# EAGLE schematic alltogether_8.2_4w (EAGLE 9.1.0), part 2 of 3
## Sheet 18 of 31
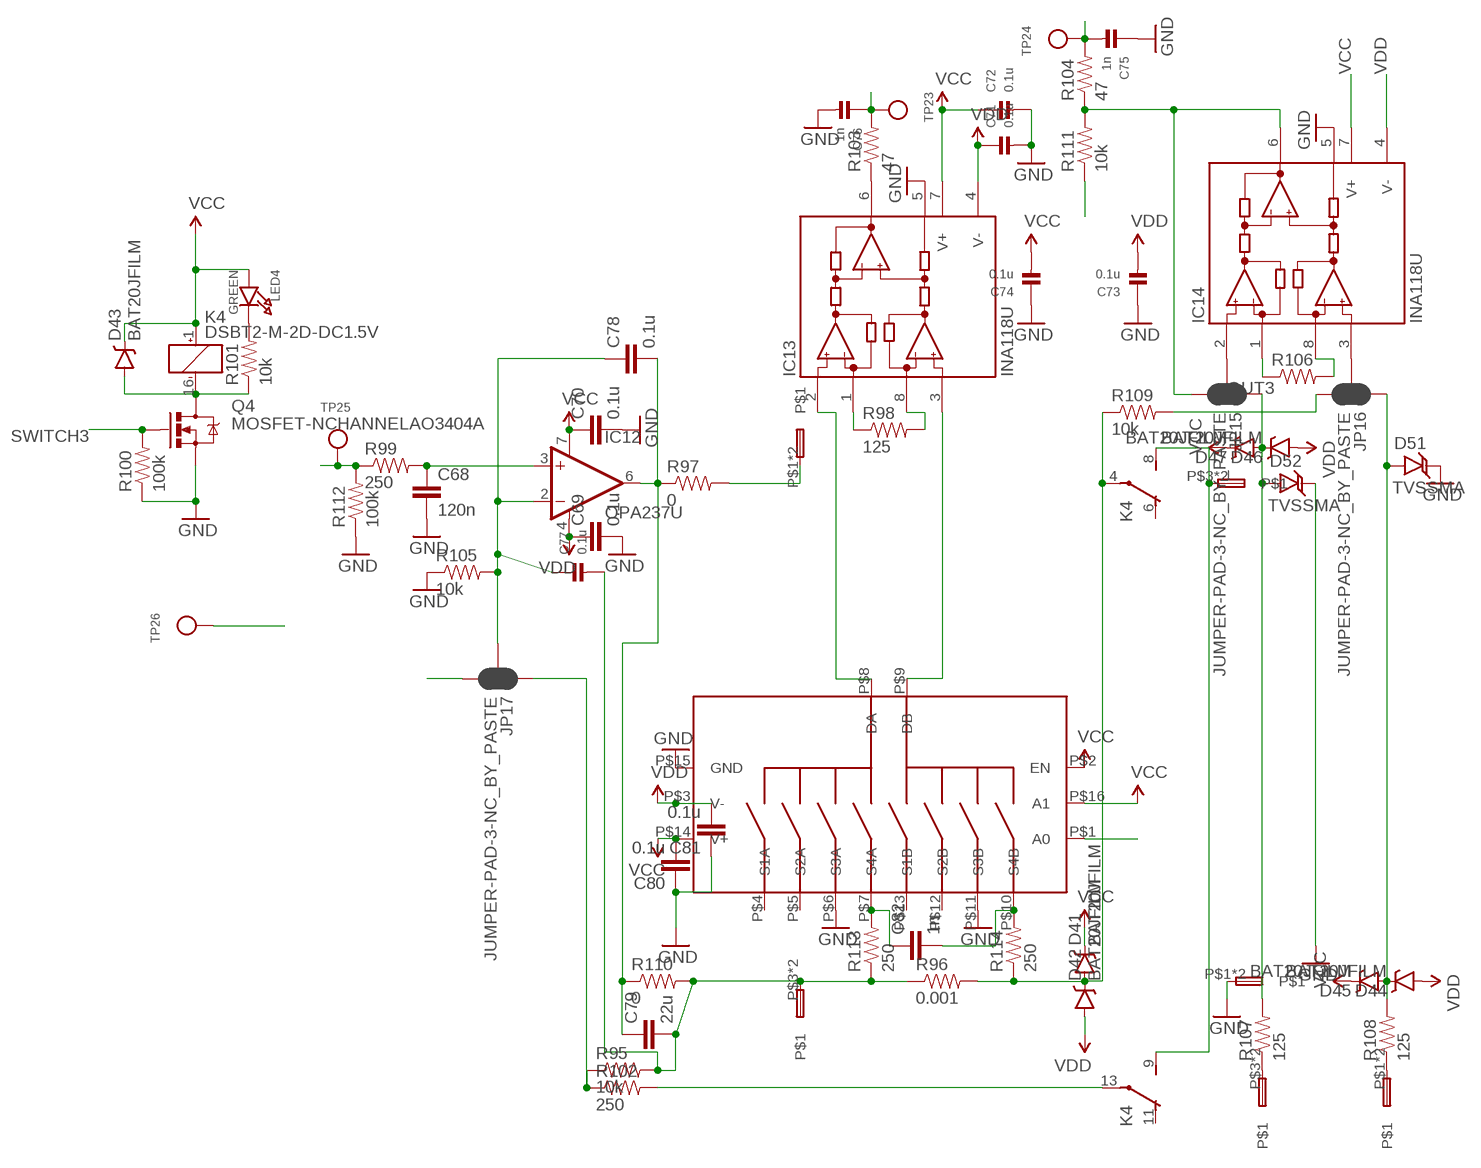
[diagram p17: schematic, sheet 18]

### Parts
C68  120n  CAP0402-CAP  [0402-CAP]
C69  0.1u  CAP0402-CAP  [0402-CAP]
C70  0.1u  CAP0402-CAP  [0402-CAP]
C71  0.1u  CAP_CERAMIC0402  [0402]
C72  0.1u  CAP_CERAMIC0402  [0402]
C73  0.1u  CAP_CERAMIC0402  [0402]
C74  0.1u  CAP_CERAMIC0402  [0402]
C75  1n  CAP_CERAMIC0402  [0402]
C76  1n  CAP_CERAMIC0402  [0402]
C77  0.1u  CAP_CERAMIC0402  [0402]
C78  0.1u  CAP0603-CAP  [0603-CAP]
C79  22u  CAP0805  [0805]
C80  0.1u  CAP0402-CAP  [0402-CAP]
C81  0.1u  CAP0402-CAP  [0402-CAP]
C82  1n  CAP0402-CAP  [0402-CAP]
D41  BAT20JFILM  [SOD-323]
D42  BAT20JFILM  [SOD-323]
D43  BAT20JFILM  [SOD-323]
D44  BAT20JFILM  [SOD-323]
D45  BAT20JFILM  [SOD-323]
D46  BAT20JFILM  [SOD-323]
D47  BAT20JFILM  [SOD-323]
D51  TVSSMA  [SMA-DIODE]
D52  TVSSMA  [SMA-DIODE]
IC12  OPA237U  [SO08]
IC13  INA118U  [SO08]
IC14  INA118U  [SO08]
JP15  JUMPER-PAD-3-NC_BY_PASTE  [PAD-JUMPER-3-NC_BY_PASTE_YES_SILK_FULL_BOX]
JP16  JUMPER-PAD-3-NC_BY_PASTE  [PAD-JUMPER-3-NC_BY_PASTE_YES_SILK_FULL_BOX]
JP17  JUMPER-PAD-3-NC_BY_PASTE  [PAD-JUMPER-3-NC_BY_PASTE_YES_SILK_FULL_BOX]
K4  DSBT2-M-2D-DC1.5V  [DS-BT]
LED4  GREEN  LED0603  [CHIPLED_0603]
Q4  MOSFET-NCHANNELAO3404A  [SOT23-3]
R95  10k  RESISTOR0402-RES  [0402-RES]
R96  0.001  0.001OHM-3W-1%(2512)3W/1%  [2512]
R97  0  RESISTOR0402-RES  [0402-RES]
R98  125  RESISTOR1206  [1206]
R99  250  RESISTOR0402-RES  [0402-RES]
R100  100k  RESISTOR0402-RES  [0402-RES]
R101  10k  RESISTOR0402-RES  [0402-RES]
R102  250  RESISTOR0402-RES  [0402-RES]
R103  47  RESISTOR0402-RES  [0402-RES]
R104  47  RESISTOR0402-RES  [0402-RES]
R105  10k  RESISTOR0402-RES  [0402-RES]
R106  RESISTOR1206  [1206]
R107  125  RESISTOR0402-RES  [0402-RES]
R108  125  RESISTOR0402-RES  [0402-RES]
R109  10k  RESISTOR0402-RES  [0402-RES]
R110  0  RESISTOR0805-RES  [0805]
R111  10k  RESISTOR0402-RES  [0402-RES]
R112  100k  RESISTOR0402-RES  [0402-RES]
R113  250  RESISTOR0402-RES  [0402-RES]
R114  250  RESISTOR0402-RES  [0402-RES]
TP23  TESTPOINT0.1"  [1X01_ROUND]
TP24  TESTPOINT0.1"  [1X01_ROUND]
TP25  TESTPOINT0.1"  [1X01_ROUND]
TP26  TESTPOINT0.1"  [1X01_ROUND]
U$20  SPTAF1/2-3.5  [SPTAF1/2-3.5]
U$21  SPTAF1/2-3.5  [SPTAF1/2-3.5]
U$22  SPTAF1/2-3.5  [SPTAF1/2-3.5]
U$23  MUX509  [R-PDSO-G16]

### Nets
A0: TP26.1 U$23.P$1(A0) ; also sheet 2,16,17,19,20,21,22,23,24,25,26,27,28,29,30,31
DAC3: R99.1 R112.2 TP25.1 ; also sheet 10
FB3: JP17.3 R111.1
GND: C68.2 C69.2 C70.2 C71.2 C72.2 C73.1 C74.1 C75.1 C76.2 C80.1 C81.1 D51.C D52.C IC13.5(REF) IC14.5(REF) Q4.2(S) R100.1 R105.1 R112.1 U$21.P$1 U$21.P$2 U$23.P$6(S3A) U$23.P$11(S3B) U$23.P$15(GND) ; also sheet 1,2,3,4,5,6,7,8,9,10,11,12,13,15,16,17,19,20,21,22,23,24,25,26,27,28,29,30,31
N$132: D41.A D42.C K4.4(2:P) R96.2 R109.1 R114.1
N$133: K4.13(3:P) R102.2
N$152: IC13.1(RG) R98.1
N$153: IC13.8(RG) R98.2
N$156: C68.1 IC12.3(+IN) R99.2
N$160: D43.A K4.16(1:-) Q4.3(D) R101.1
N$172: LED4.C R101.2
N$173: C77.1 C78.1 IC12.2(-IN) JP17.2 R105.2
N$174: C77.2 C79.2 R95.2 R96.1 R110.2 R113.1 U$20.P$3 U$20.P$4
N$175: IC13.6(OUT) R103.1
N$176: IC14.6(OUT) JP15.3 R104.1 R111.2
N$177: C78.2 C79.1 IC12.6(OUT) R97.1 R110.1
N$178: IC14.1(RG) R106.1
N$179: IC14.8(RG) R106.2
N$180: IC14.2(-IN) JP15.2
N$181: IC14.3(+IN) JP16.2
N$182: D46.C D47.A D52.A JP15.1 R107.2
N$185: R107.1 U$22.P$3 U$22.P$4
N$186: D44.C D45.A D51.A JP16.1 R108.2
N$192: R108.1 U$22.P$1 U$22.P$2
N$193: JP16.3 R109.2
N$196: JP17.1 R95.1 R102.1
N$201: R97.2 U$20.P$1 U$20.P$2
N$202: IC13.2(-IN) U$23.P$8(DA)
N$203: IC13.3(+IN) U$23.P$9(DB)
N$204: C82.2 R114.2 U$23.P$10(S4B)
N$205: C82.1 R113.2 U$23.P$7(S4A)
OUT3: K4.8(2:S) K4.9(3:S) U$21.P$3 U$21.P$4
SENSEI3: C76.1 R103.2 TP23.1 ; also sheet 8
SENSEV3: C75.2 R104.2 TP24.1 ; also sheet 8
SWITCH3: Q4.1(G) R100.2 ; also sheet 6
VCC: C70.1 C72.1 C74.2 C80.2 D41.C D43.C D45.C D47.C IC12.7(V+) IC13.7(V+) IC14.7(V+) K4.1(1:+) LED4.A U$23.P$2(EN) U$23.P$14(V+) U$23.P$16(A1) ; also sheet 1,2,3,7,8,11,13,15,16,17,19,20,21,22,23,24,25,26,27,28,29,30,31
VDD: C69.1 C71.1 C73.2 C81.2 D42.A D44.A D46.A IC12.4(V-) IC13.4(V-) IC14.4(V-) U$23.P$3(V-) ; also sheet 1,3,7,8,15,16,17,19,20,21,22,23,24,25,26,27,28,29,30,31
Unconnected: K4.6(2:O) K4.11(3:O) U$23.P$4(S1A) U$23.P$5(S2A) U$23.P$12(S2B) U$23.P$13(S1B)

## Sheet 19 of 31
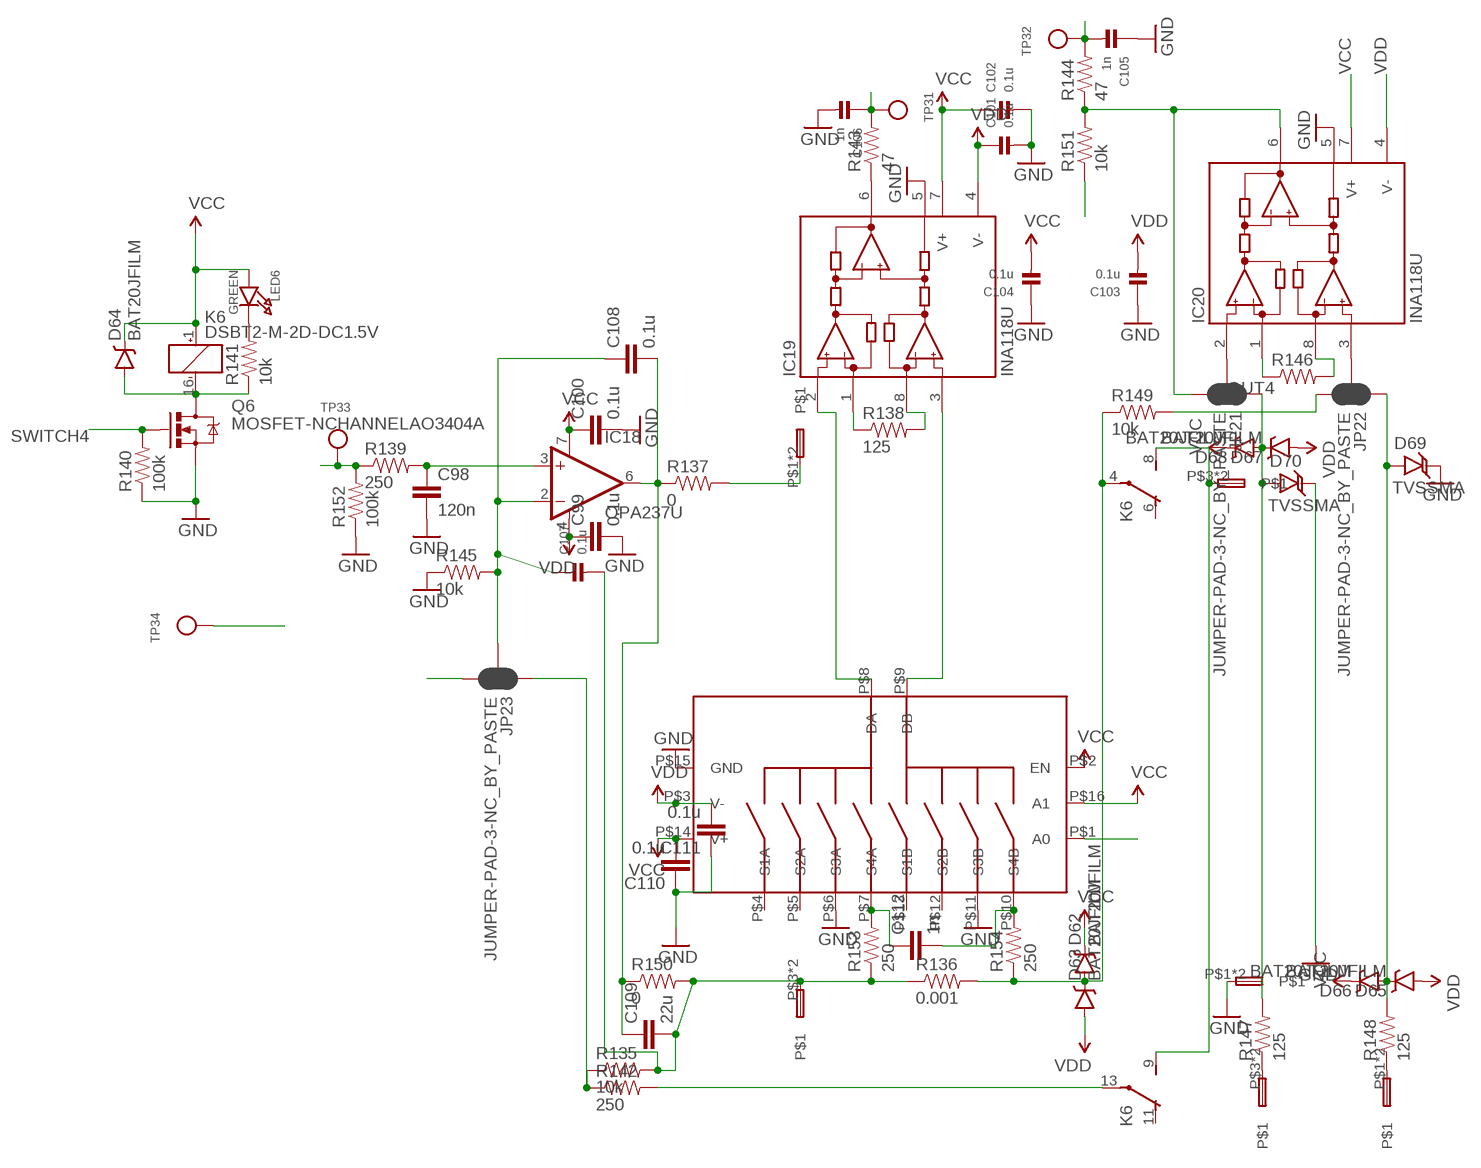
[diagram p18: schematic, sheet 19]

### Parts
C98  120n  CAP0402-CAP  [0402-CAP]
C99  0.1u  CAP0402-CAP  [0402-CAP]
C100  0.1u  CAP0402-CAP  [0402-CAP]
C101  0.1u  CAP_CERAMIC0402  [0402]
C102  0.1u  CAP_CERAMIC0402  [0402]
C103  0.1u  CAP_CERAMIC0402  [0402]
C104  0.1u  CAP_CERAMIC0402  [0402]
C105  1n  CAP_CERAMIC0402  [0402]
C106  1n  CAP_CERAMIC0402  [0402]
C107  0.1u  CAP_CERAMIC0402  [0402]
C108  0.1u  CAP0603-CAP  [0603-CAP]
C109  22u  CAP0805  [0805]
C110  0.1u  CAP0402-CAP  [0402-CAP]
C111  0.1u  CAP0402-CAP  [0402-CAP]
C112  1n  CAP0402-CAP  [0402-CAP]
D62  BAT20JFILM  [SOD-323]
D63  BAT20JFILM  [SOD-323]
D64  BAT20JFILM  [SOD-323]
D65  BAT20JFILM  [SOD-323]
D66  BAT20JFILM  [SOD-323]
D67  BAT20JFILM  [SOD-323]
D68  BAT20JFILM  [SOD-323]
D69  TVSSMA  [SMA-DIODE]
D70  TVSSMA  [SMA-DIODE]
IC18  OPA237U  [SO08]
IC19  INA118U  [SO08]
IC20  INA118U  [SO08]
JP21  JUMPER-PAD-3-NC_BY_PASTE  [PAD-JUMPER-3-NC_BY_PASTE_YES_SILK_FULL_BOX]
JP22  JUMPER-PAD-3-NC_BY_PASTE  [PAD-JUMPER-3-NC_BY_PASTE_YES_SILK_FULL_BOX]
JP23  JUMPER-PAD-3-NC_BY_PASTE  [PAD-JUMPER-3-NC_BY_PASTE_YES_SILK_FULL_BOX]
K6  DSBT2-M-2D-DC1.5V  [DS-BT]
LED6  GREEN  LED0603  [CHIPLED_0603]
Q6  MOSFET-NCHANNELAO3404A  [SOT23-3]
R135  10k  RESISTOR0402-RES  [0402-RES]
R136  0.001  0.001OHM-3W-1%(2512)3W/1%  [2512]
R137  0  RESISTOR0402-RES  [0402-RES]
R138  125  RESISTOR1206  [1206]
R139  250  RESISTOR0402-RES  [0402-RES]
R140  100k  RESISTOR0402-RES  [0402-RES]
R141  10k  RESISTOR0402-RES  [0402-RES]
R142  250  RESISTOR0402-RES  [0402-RES]
R143  47  RESISTOR0402-RES  [0402-RES]
R144  47  RESISTOR0402-RES  [0402-RES]
R145  10k  RESISTOR0402-RES  [0402-RES]
R146  RESISTOR1206  [1206]
R147  125  RESISTOR0402-RES  [0402-RES]
R148  125  RESISTOR0402-RES  [0402-RES]
R149  10k  RESISTOR0402-RES  [0402-RES]
R150  0  RESISTOR0805-RES  [0805]
R151  10k  RESISTOR0402-RES  [0402-RES]
R152  100k  RESISTOR0402-RES  [0402-RES]
R153  250  RESISTOR0402-RES  [0402-RES]
R154  250  RESISTOR0402-RES  [0402-RES]
TP31  TESTPOINT0.1"  [1X01_ROUND]
TP32  TESTPOINT0.1"  [1X01_ROUND]
TP33  TESTPOINT0.1"  [1X01_ROUND]
TP34  TESTPOINT0.1"  [1X01_ROUND]
U$28  SPTAF1/2-3.5  [SPTAF1/2-3.5]
U$29  SPTAF1/2-3.5  [SPTAF1/2-3.5]
U$30  SPTAF1/2-3.5  [SPTAF1/2-3.5]
U$31  MUX509  [R-PDSO-G16]

### Nets
A0: TP34.1 U$31.P$1(A0) ; also sheet 2,16,17,18,20,21,22,23,24,25,26,27,28,29,30,31
DAC4: R139.1 R152.2 TP33.1 ; also sheet 10
FB4: JP23.3 R151.1
GND: C98.2 C99.2 C100.2 C101.2 C102.2 C103.1 C104.1 C105.1 C106.2 C110.1 C111.1 D69.C D70.C IC19.5(REF) IC20.5(REF) Q6.2(S) R140.1 R145.1 R152.1 U$29.P$1 U$29.P$2 U$31.P$6(S3A) U$31.P$11(S3B) U$31.P$15(GND) ; also sheet 1,2,3,4,5,6,7,8,9,10,11,12,13,15,16,17,18,20,21,22,23,24,25,26,27,28,29,30,31
N$285: D62.A D63.C K6.4(2:P) R136.2 R149.1 R154.1
N$286: K6.13(3:P) R142.2
N$287: IC19.1(RG) R138.1
N$288: IC19.8(RG) R138.2
N$289: C98.1 IC18.3(+IN) R139.2
N$290: D64.A K6.16(1:-) Q6.3(D) R141.1
N$291: LED6.C R141.2
N$301: C107.1 C108.1 IC18.2(-IN) JP23.2 R145.2
N$310: C107.2 C109.2 R135.2 R136.1 R150.2 R153.1 U$28.P$3 U$28.P$4
N$311: IC19.6(OUT) R143.1
N$312: IC20.6(OUT) JP21.3 R144.1 R151.2
N$314: C108.2 C109.1 IC18.6(OUT) R137.1 R150.1
N$317: IC20.1(RG) R146.1
N$318: IC20.8(RG) R146.2
N$319: IC20.2(-IN) JP21.2
N$320: IC20.3(+IN) JP22.2
N$321: D67.C D68.A D70.A JP21.1 R147.2
N$322: R147.1 U$30.P$3 U$30.P$4
N$323: D65.C D66.A D69.A JP22.1 R148.2
N$324: R148.1 U$30.P$1 U$30.P$2
N$325: JP22.3 R149.2
N$326: JP23.1 R135.1 R142.1
N$327: R137.2 U$28.P$1 U$28.P$2
N$328: IC19.2(-IN) U$31.P$8(DA)
N$329: IC19.3(+IN) U$31.P$9(DB)
N$330: C112.2 R154.2 U$31.P$10(S4B)
N$331: C112.1 R153.2 U$31.P$7(S4A)
OUT4: K6.8(2:S) K6.9(3:S) U$29.P$3 U$29.P$4
SENSEI4: C106.1 R143.2 TP31.1 ; also sheet 8
SENSEV4: C105.2 R144.2 TP32.1 ; also sheet 8
SWITCH4: Q6.1(G) R140.2 ; also sheet 6
VCC: C100.1 C102.1 C104.2 C110.2 D62.C D64.C D66.C D68.C IC18.7(V+) IC19.7(V+) IC20.7(V+) K6.1(1:+) LED6.A U$31.P$2(EN) U$31.P$14(V+) U$31.P$16(A1) ; also sheet 1,2,3,7,8,11,13,15,16,17,18,20,21,22,23,24,25,26,27,28,29,30,31
VDD: C99.1 C101.1 C103.2 C111.2 D63.A D65.A D67.A IC18.4(V-) IC19.4(V-) IC20.4(V-) U$31.P$3(V-) ; also sheet 1,3,7,8,15,16,17,18,20,21,22,23,24,25,26,27,28,29,30,31
Unconnected: K6.6(2:O) K6.11(3:O) U$31.P$4(S1A) U$31.P$5(S2A) U$31.P$12(S2B) U$31.P$13(S1B)

## Sheet 20 of 31
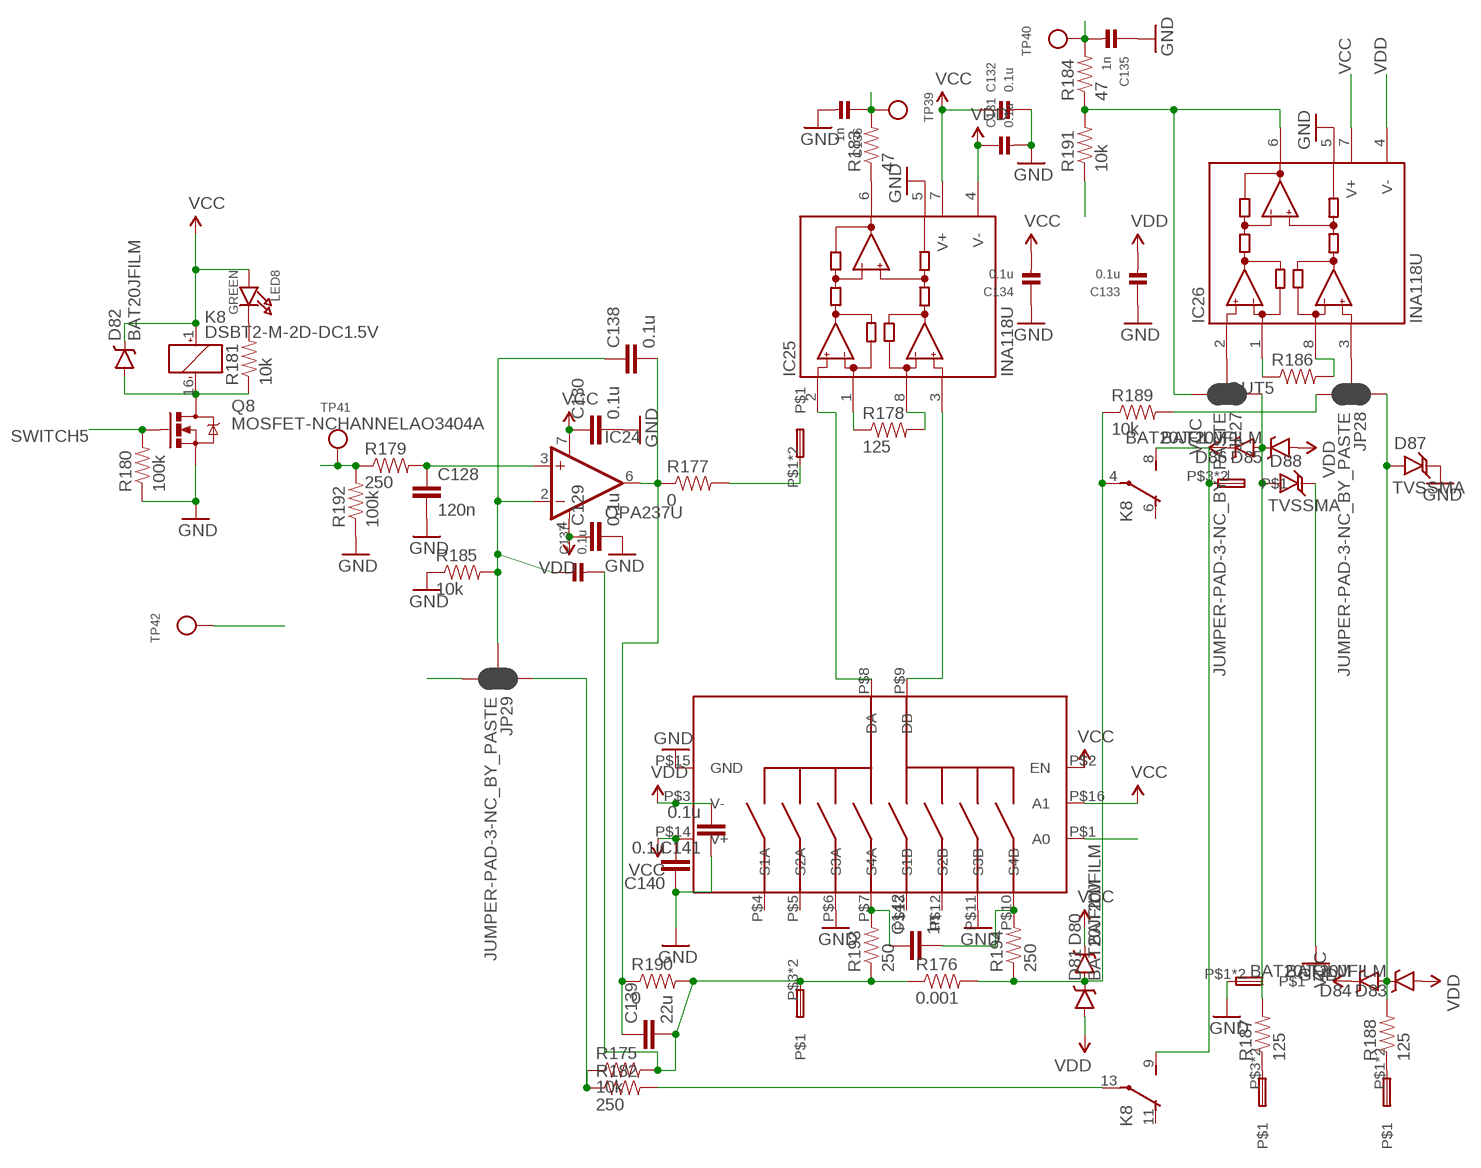
[diagram p19: schematic, sheet 20]

### Parts
C128  120n  CAP0402-CAP  [0402-CAP]
C129  0.1u  CAP0402-CAP  [0402-CAP]
C130  0.1u  CAP0402-CAP  [0402-CAP]
C131  0.1u  CAP_CERAMIC0402  [0402]
C132  0.1u  CAP_CERAMIC0402  [0402]
C133  0.1u  CAP_CERAMIC0402  [0402]
C134  0.1u  CAP_CERAMIC0402  [0402]
C135  1n  CAP_CERAMIC0402  [0402]
C136  1n  CAP_CERAMIC0402  [0402]
C137  0.1u  CAP_CERAMIC0402  [0402]
C138  0.1u  CAP0603-CAP  [0603-CAP]
C139  22u  CAP0805  [0805]
C140  0.1u  CAP0402-CAP  [0402-CAP]
C141  0.1u  CAP0402-CAP  [0402-CAP]
C142  1n  CAP0402-CAP  [0402-CAP]
D80  BAT20JFILM  [SOD-323]
D81  BAT20JFILM  [SOD-323]
D82  BAT20JFILM  [SOD-323]
D83  BAT20JFILM  [SOD-323]
D84  BAT20JFILM  [SOD-323]
D85  BAT20JFILM  [SOD-323]
D86  BAT20JFILM  [SOD-323]
D87  TVSSMA  [SMA-DIODE]
D88  TVSSMA  [SMA-DIODE]
IC24  OPA237U  [SO08]
IC25  INA118U  [SO08]
IC26  INA118U  [SO08]
JP27  JUMPER-PAD-3-NC_BY_PASTE  [PAD-JUMPER-3-NC_BY_PASTE_YES_SILK_FULL_BOX]
JP28  JUMPER-PAD-3-NC_BY_PASTE  [PAD-JUMPER-3-NC_BY_PASTE_YES_SILK_FULL_BOX]
JP29  JUMPER-PAD-3-NC_BY_PASTE  [PAD-JUMPER-3-NC_BY_PASTE_YES_SILK_FULL_BOX]
K8  DSBT2-M-2D-DC1.5V  [DS-BT]
LED8  GREEN  LED0603  [CHIPLED_0603]
Q8  MOSFET-NCHANNELAO3404A  [SOT23-3]
R175  10k  RESISTOR0402-RES  [0402-RES]
R176  0.001  0.001OHM-3W-1%(2512)3W/1%  [2512]
R177  0  RESISTOR0402-RES  [0402-RES]
R178  125  RESISTOR1206  [1206]
R179  250  RESISTOR0402-RES  [0402-RES]
R180  100k  RESISTOR0402-RES  [0402-RES]
R181  10k  RESISTOR0402-RES  [0402-RES]
R182  250  RESISTOR0402-RES  [0402-RES]
R183  47  RESISTOR0402-RES  [0402-RES]
R184  47  RESISTOR0402-RES  [0402-RES]
R185  10k  RESISTOR0402-RES  [0402-RES]
R186  RESISTOR1206  [1206]
R187  125  RESISTOR0402-RES  [0402-RES]
R188  125  RESISTOR0402-RES  [0402-RES]
R189  10k  RESISTOR0402-RES  [0402-RES]
R190  0  RESISTOR0805-RES  [0805]
R191  10k  RESISTOR0402-RES  [0402-RES]
R192  100k  RESISTOR0402-RES  [0402-RES]
R193  250  RESISTOR0402-RES  [0402-RES]
R194  250  RESISTOR0402-RES  [0402-RES]
TP39  TESTPOINT0.1"  [1X01_ROUND]
TP40  TESTPOINT0.1"  [1X01_ROUND]
TP41  TESTPOINT0.1"  [1X01_ROUND]
TP42  TESTPOINT0.1"  [1X01_ROUND]
U$37  SPTAF1/2-3.5  [SPTAF1/2-3.5]
U$39  SPTAF1/2-3.5  [SPTAF1/2-3.5]
U$40  SPTAF1/2-3.5  [SPTAF1/2-3.5]
U$41  MUX509  [R-PDSO-G16]

### Nets
A0: TP42.1 U$41.P$1(A0) ; also sheet 2,16,17,18,19,21,22,23,24,25,26,27,28,29,30,31
DAC5: R179.1 R192.2 TP41.1 ; also sheet 10
FB5: JP29.3 R191.1
GND: C128.2 C129.2 C130.2 C131.2 C132.2 C133.1 C134.1 C135.1 C136.2 C140.1 C141.1 D87.C D88.C IC25.5(REF) IC26.5(REF) Q8.2(S) R180.1 R185.1 R192.1 U$39.P$1 U$39.P$2 U$41.P$6(S3A) U$41.P$11(S3B) U$41.P$15(GND) ; also sheet 1,2,3,4,5,6,7,8,9,10,11,12,13,15,16,17,18,19,21,22,23,24,25,26,27,28,29,30,31
N$359: D80.A D81.C K8.4(2:P) R176.2 R189.1 R194.1
N$360: K8.13(3:P) R182.2
N$361: IC25.1(RG) R178.1
N$362: IC25.8(RG) R178.2
N$363: C128.1 IC24.3(+IN) R179.2
N$364: D82.A K8.16(1:-) Q8.3(D) R181.1
N$365: LED8.C R181.2
N$366: C137.1 C138.1 IC24.2(-IN) JP29.2 R185.2
N$367: C137.2 C139.2 R175.2 R176.1 R190.2 R193.1 U$37.P$3 U$37.P$4
N$368: IC25.6(OUT) R183.1
N$369: IC26.6(OUT) JP27.3 R184.1 R191.2
N$370: C138.2 C139.1 IC24.6(OUT) R177.1 R190.1
N$371: IC26.1(RG) R186.1
N$372: IC26.8(RG) R186.2
N$373: IC26.2(-IN) JP27.2
N$374: IC26.3(+IN) JP28.2
N$375: D85.C D86.A D88.A JP27.1 R187.2
N$376: R187.1 U$40.P$3 U$40.P$4
N$377: D83.C D84.A D87.A JP28.1 R188.2
N$378: R188.1 U$40.P$1 U$40.P$2
N$379: JP28.3 R189.2
N$380: JP29.1 R175.1 R182.1
N$381: R177.2 U$37.P$1 U$37.P$2
N$382: IC25.2(-IN) U$41.P$8(DA)
N$383: IC25.3(+IN) U$41.P$9(DB)
N$384: C142.2 R194.2 U$41.P$10(S4B)
N$385: C142.1 R193.2 U$41.P$7(S4A)
OUT5: K8.8(2:S) K8.9(3:S) U$39.P$3 U$39.P$4
SENSEI5: C136.1 R183.2 TP39.1 ; also sheet 8
SENSEV5: C135.2 R184.2 TP40.1 ; also sheet 8
SWITCH5: Q8.1(G) R180.2 ; also sheet 6
VCC: C130.1 C132.1 C134.2 C140.2 D80.C D82.C D84.C D86.C IC24.7(V+) IC25.7(V+) IC26.7(V+) K8.1(1:+) LED8.A U$41.P$2(EN) U$41.P$14(V+) U$41.P$16(A1) ; also sheet 1,2,3,7,8,11,13,15,16,17,18,19,21,22,23,24,25,26,27,28,29,30,31
VDD: C129.1 C131.1 C133.2 C141.2 D81.A D83.A D85.A IC24.4(V-) IC25.4(V-) IC26.4(V-) U$41.P$3(V-) ; also sheet 1,3,7,8,15,16,17,18,19,21,22,23,24,25,26,27,28,29,30,31
Unconnected: K8.6(2:O) K8.11(3:O) U$41.P$4(S1A) U$41.P$5(S2A) U$41.P$12(S2B) U$41.P$13(S1B)

## Sheet 21 of 31
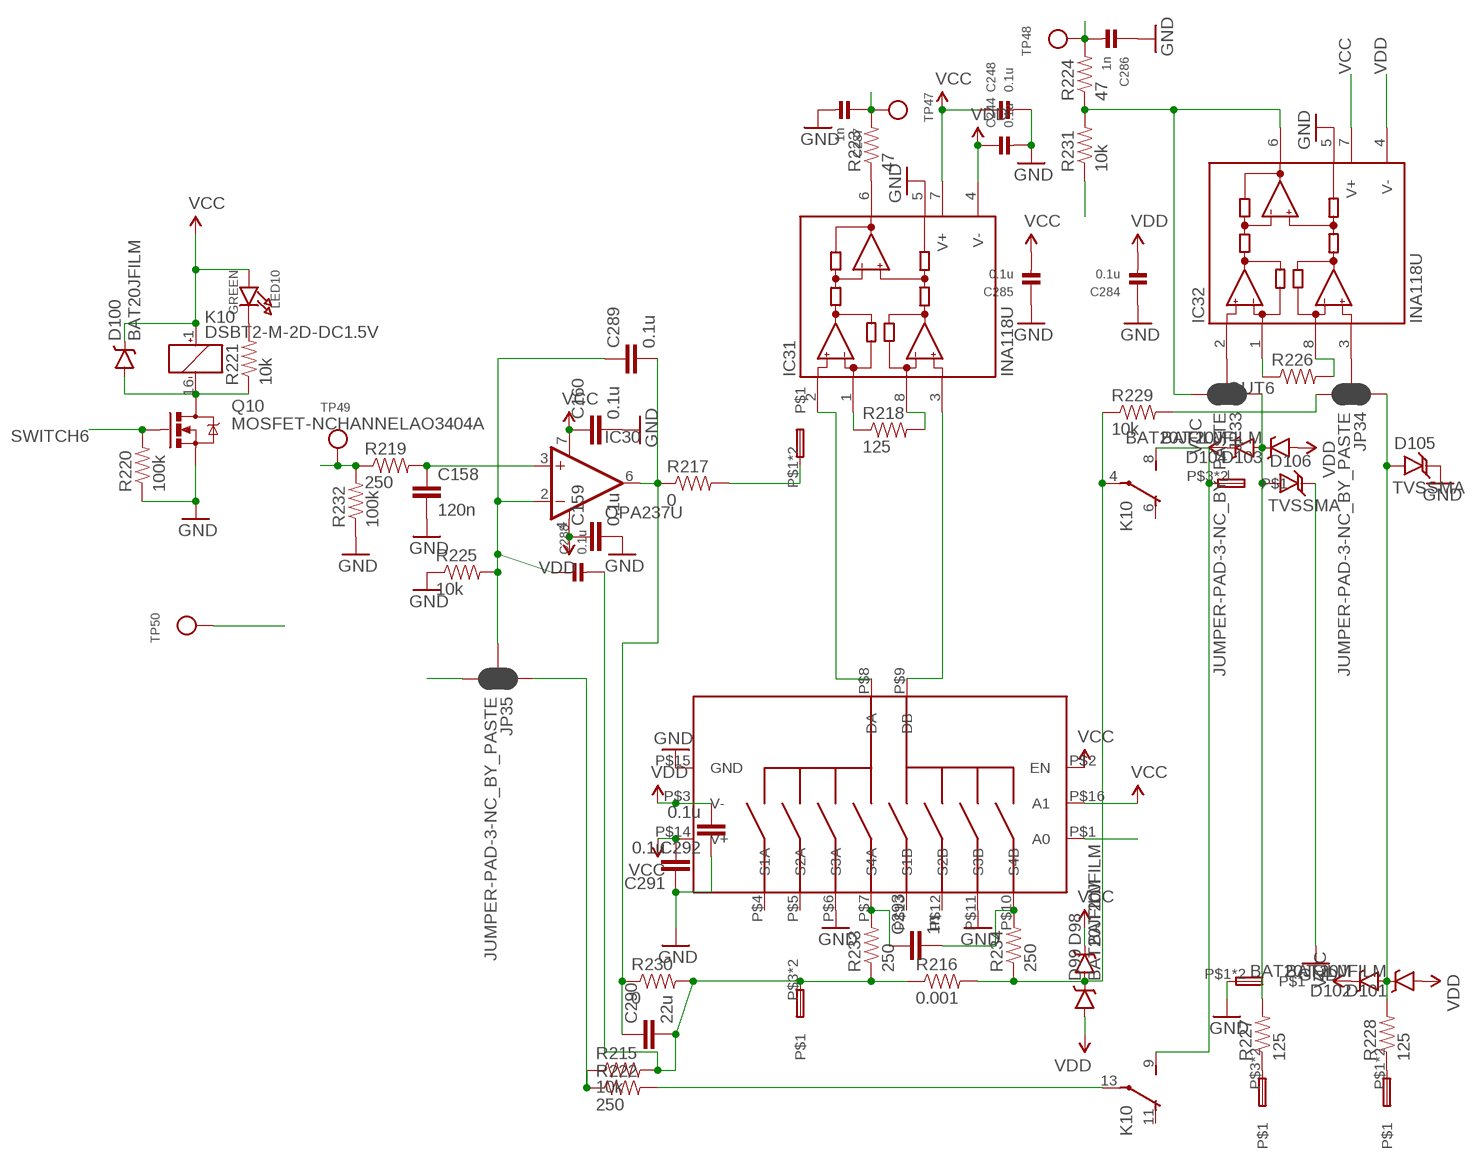
[diagram p20: schematic, sheet 21]

### Parts
C158  120n  CAP0402-CAP  [0402-CAP]
C159  0.1u  CAP0402-CAP  [0402-CAP]
C160  0.1u  CAP0402-CAP  [0402-CAP]
C244  0.1u  CAP_CERAMIC0402  [0402]
C248  0.1u  CAP_CERAMIC0402  [0402]
C284  0.1u  CAP_CERAMIC0402  [0402]
C285  0.1u  CAP_CERAMIC0402  [0402]
C286  1n  CAP_CERAMIC0402  [0402]
C287  1n  CAP_CERAMIC0402  [0402]
C288  0.1u  CAP_CERAMIC0402  [0402]
C289  0.1u  CAP0603-CAP  [0603-CAP]
C290  22u  CAP0805  [0805]
C291  0.1u  CAP0402-CAP  [0402-CAP]
C292  0.1u  CAP0402-CAP  [0402-CAP]
C293  1n  CAP0402-CAP  [0402-CAP]
D98  BAT20JFILM  [SOD-323]
D99  BAT20JFILM  [SOD-323]
D100  BAT20JFILM  [SOD-323]
D101  BAT20JFILM  [SOD-323]
D102  BAT20JFILM  [SOD-323]
D103  BAT20JFILM  [SOD-323]
D104  BAT20JFILM  [SOD-323]
D105  TVSSMA  [SMA-DIODE]
D106  TVSSMA  [SMA-DIODE]
IC30  OPA237U  [SO08]
IC31  INA118U  [SO08]
IC32  INA118U  [SO08]
JP33  JUMPER-PAD-3-NC_BY_PASTE  [PAD-JUMPER-3-NC_BY_PASTE_YES_SILK_FULL_BOX]
JP34  JUMPER-PAD-3-NC_BY_PASTE  [PAD-JUMPER-3-NC_BY_PASTE_YES_SILK_FULL_BOX]
JP35  JUMPER-PAD-3-NC_BY_PASTE  [PAD-JUMPER-3-NC_BY_PASTE_YES_SILK_FULL_BOX]
K10  DSBT2-M-2D-DC1.5V  [DS-BT]
LED10  GREEN  LED0603  [CHIPLED_0603]
Q10  MOSFET-NCHANNELAO3404A  [SOT23-3]
R215  10k  RESISTOR0402-RES  [0402-RES]
R216  0.001  0.001OHM-3W-1%(2512)3W/1%  [2512]
R217  0  RESISTOR0402-RES  [0402-RES]
R218  125  RESISTOR1206  [1206]
R219  250  RESISTOR0402-RES  [0402-RES]
R220  100k  RESISTOR0402-RES  [0402-RES]
R221  10k  RESISTOR0402-RES  [0402-RES]
R222  250  RESISTOR0402-RES  [0402-RES]
R223  47  RESISTOR0402-RES  [0402-RES]
R224  47  RESISTOR0402-RES  [0402-RES]
R225  10k  RESISTOR0402-RES  [0402-RES]
R226  RESISTOR1206  [1206]
R227  125  RESISTOR0402-RES  [0402-RES]
R228  125  RESISTOR0402-RES  [0402-RES]
R229  10k  RESISTOR0402-RES  [0402-RES]
R230  0  RESISTOR0805-RES  [0805]
R231  10k  RESISTOR0402-RES  [0402-RES]
R232  100k  RESISTOR0402-RES  [0402-RES]
R233  250  RESISTOR0402-RES  [0402-RES]
R234  250  RESISTOR0402-RES  [0402-RES]
TP47  TESTPOINT0.1"  [1X01_ROUND]
TP48  TESTPOINT0.1"  [1X01_ROUND]
TP49  TESTPOINT0.1"  [1X01_ROUND]
TP50  TESTPOINT0.1"  [1X01_ROUND]
U$46  SPTAF1/2-3.5  [SPTAF1/2-3.5]
U$47  SPTAF1/2-3.5  [SPTAF1/2-3.5]
U$51  SPTAF1/2-3.5  [SPTAF1/2-3.5]
U$52  MUX509  [R-PDSO-G16]

### Nets
A0: TP50.1 U$52.P$1(A0) ; also sheet 2,16,17,18,19,20,22,23,24,25,26,27,28,29,30,31
DAC6: R219.1 R232.2 TP49.1 ; also sheet 10
FB6: JP35.3 R231.1
GND: C158.2 C159.2 C160.2 C244.2 C248.2 C284.1 C285.1 C286.1 C287.2 C291.1 C292.1 D105.C D106.C IC31.5(REF) IC32.5(REF) Q10.2(S) R220.1 R225.1 R232.1 U$47.P$1 U$47.P$2 U$52.P$6(S3A) U$52.P$11(S3B) U$52.P$15(GND) ; also sheet 1,2,3,4,5,6,7,8,9,10,11,12,13,15,16,17,18,19,20,22,23,24,25,26,27,28,29,30,31
N$413: D98.A D99.C K10.4(2:P) R216.2 R229.1 R234.1
N$414: K10.13(3:P) R222.2
N$415: IC31.1(RG) R218.1
N$416: IC31.8(RG) R218.2
N$417: C158.1 IC30.3(+IN) R219.2
N$418: D100.A K10.16(1:-) Q10.3(D) R221.1
N$419: LED10.C R221.2
N$420: C288.1 C289.1 IC30.2(-IN) JP35.2 R225.2
N$421: C288.2 C290.2 R215.2 R216.1 R230.2 R233.1 U$46.P$3 U$46.P$4
N$422: IC31.6(OUT) R223.1
N$423: IC32.6(OUT) JP33.3 R224.1 R231.2
N$424: C289.2 C290.1 IC30.6(OUT) R217.1 R230.1
N$425: IC32.1(RG) R226.1
N$426: IC32.8(RG) R226.2
N$427: IC32.2(-IN) JP33.2
N$428: IC32.3(+IN) JP34.2
N$429: D103.C D104.A D106.A JP33.1 R227.2
N$430: R227.1 U$51.P$3 U$51.P$4
N$431: D101.C D102.A D105.A JP34.1 R228.2
N$432: R228.1 U$51.P$1 U$51.P$2
N$433: JP34.3 R229.2
N$434: JP35.1 R215.1 R222.1
N$435: R217.2 U$46.P$1 U$46.P$2
N$436: IC31.2(-IN) U$52.P$8(DA)
N$437: IC31.3(+IN) U$52.P$9(DB)
N$438: C293.2 R234.2 U$52.P$10(S4B)
N$439: C293.1 R233.2 U$52.P$7(S4A)
OUT6: K10.8(2:S) K10.9(3:S) U$47.P$3 U$47.P$4
SENSEI6: C287.1 R223.2 TP47.1 ; also sheet 8
SENSEV6: C286.2 R224.2 TP48.1 ; also sheet 8
SWITCH6: Q10.1(G) R220.2 ; also sheet 6
VCC: C160.1 C248.1 C285.2 C291.2 D98.C D100.C D102.C D104.C IC30.7(V+) IC31.7(V+) IC32.7(V+) K10.1(1:+) LED10.A U$52.P$2(EN) U$52.P$14(V+) U$52.P$16(A1) ; also sheet 1,2,3,7,8,11,13,15,16,17,18,19,20,22,23,24,25,26,27,28,29,30,31
VDD: C159.1 C244.1 C284.2 C292.2 D99.A D101.A D103.A IC30.4(V-) IC31.4(V-) IC32.4(V-) U$52.P$3(V-) ; also sheet 1,3,7,8,15,16,17,18,19,20,22,23,24,25,26,27,28,29,30,31
Unconnected: K10.6(2:O) K10.11(3:O) U$52.P$4(S1A) U$52.P$5(S2A) U$52.P$12(S2B) U$52.P$13(S1B)

## Sheet 22 of 31
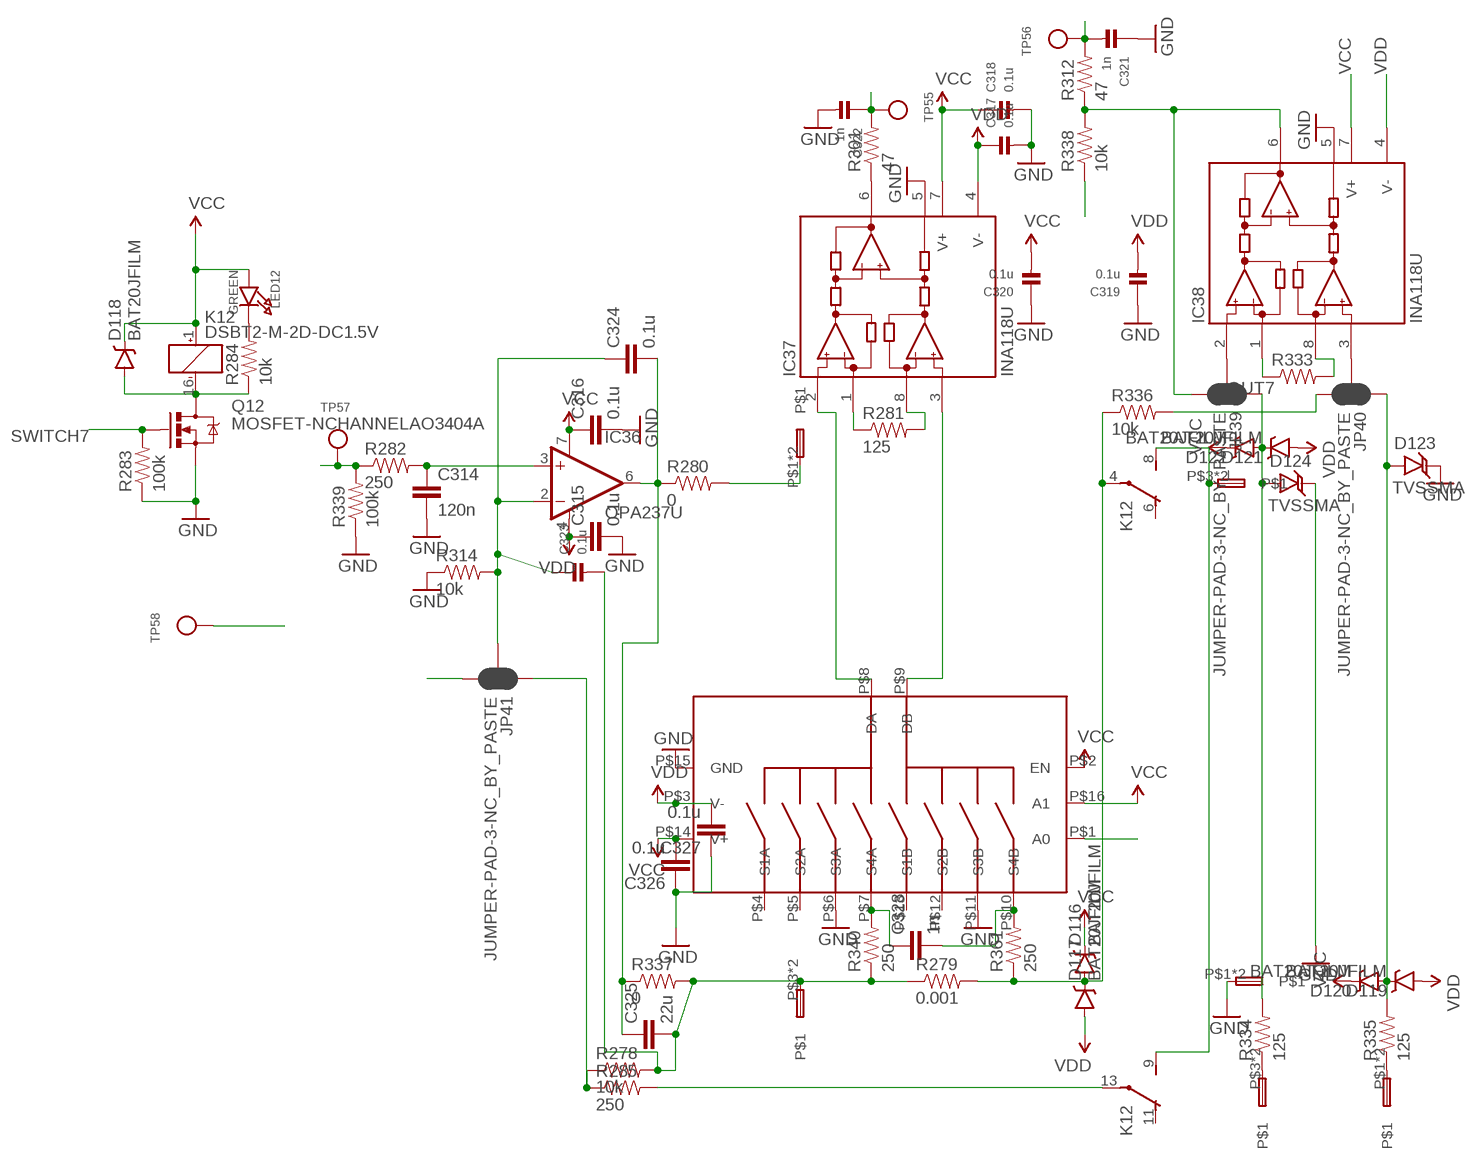
[diagram p21: schematic, sheet 22]

### Parts
C314  120n  CAP0402-CAP  [0402-CAP]
C315  0.1u  CAP0402-CAP  [0402-CAP]
C316  0.1u  CAP0402-CAP  [0402-CAP]
C317  0.1u  CAP_CERAMIC0402  [0402]
C318  0.1u  CAP_CERAMIC0402  [0402]
C319  0.1u  CAP_CERAMIC0402  [0402]
C320  0.1u  CAP_CERAMIC0402  [0402]
C321  1n  CAP_CERAMIC0402  [0402]
C322  1n  CAP_CERAMIC0402  [0402]
C323  0.1u  CAP_CERAMIC0402  [0402]
C324  0.1u  CAP0603-CAP  [0603-CAP]
C325  22u  CAP0805  [0805]
C326  0.1u  CAP0402-CAP  [0402-CAP]
C327  0.1u  CAP0402-CAP  [0402-CAP]
C328  1n  CAP0402-CAP  [0402-CAP]
D116  BAT20JFILM  [SOD-323]
D117  BAT20JFILM  [SOD-323]
D118  BAT20JFILM  [SOD-323]
D119  BAT20JFILM  [SOD-323]
D120  BAT20JFILM  [SOD-323]
D121  BAT20JFILM  [SOD-323]
D122  BAT20JFILM  [SOD-323]
D123  TVSSMA  [SMA-DIODE]
D124  TVSSMA  [SMA-DIODE]
IC36  OPA237U  [SO08]
IC37  INA118U  [SO08]
IC38  INA118U  [SO08]
JP39  JUMPER-PAD-3-NC_BY_PASTE  [PAD-JUMPER-3-NC_BY_PASTE_YES_SILK_FULL_BOX]
JP40  JUMPER-PAD-3-NC_BY_PASTE  [PAD-JUMPER-3-NC_BY_PASTE_YES_SILK_FULL_BOX]
JP41  JUMPER-PAD-3-NC_BY_PASTE  [PAD-JUMPER-3-NC_BY_PASTE_YES_SILK_FULL_BOX]
K12  DSBT2-M-2D-DC1.5V  [DS-BT]
LED12  GREEN  LED0603  [CHIPLED_0603]
Q12  MOSFET-NCHANNELAO3404A  [SOT23-3]
R278  10k  RESISTOR0402-RES  [0402-RES]
R279  0.001  0.001OHM-3W-1%(2512)3W/1%  [2512]
R280  0  RESISTOR0402-RES  [0402-RES]
R281  125  RESISTOR1206  [1206]
R282  250  RESISTOR0402-RES  [0402-RES]
R283  100k  RESISTOR0402-RES  [0402-RES]
R284  10k  RESISTOR0402-RES  [0402-RES]
R285  250  RESISTOR0402-RES  [0402-RES]
R301  47  RESISTOR0402-RES  [0402-RES]
R312  47  RESISTOR0402-RES  [0402-RES]
R314  10k  RESISTOR0402-RES  [0402-RES]
R333  RESISTOR1206  [1206]
R334  125  RESISTOR0402-RES  [0402-RES]
R335  125  RESISTOR0402-RES  [0402-RES]
R336  10k  RESISTOR0402-RES  [0402-RES]
R337  0  RESISTOR0805-RES  [0805]
R338  10k  RESISTOR0402-RES  [0402-RES]
R339  100k  RESISTOR0402-RES  [0402-RES]
R340  250  RESISTOR0402-RES  [0402-RES]
R361  250  RESISTOR0402-RES  [0402-RES]
TP55  TESTPOINT0.1"  [1X01_ROUND]
TP56  TESTPOINT0.1"  [1X01_ROUND]
TP57  TESTPOINT0.1"  [1X01_ROUND]
TP58  TESTPOINT0.1"  [1X01_ROUND]
U$57  SPTAF1/2-3.5  [SPTAF1/2-3.5]
U$58  SPTAF1/2-3.5  [SPTAF1/2-3.5]
U$61  SPTAF1/2-3.5  [SPTAF1/2-3.5]
U$65  MUX509  [R-PDSO-G16]

### Nets
A0: TP58.1 U$65.P$1(A0) ; also sheet 2,16,17,18,19,20,21,23,24,25,26,27,28,29,30,31
DAC7: R282.1 R339.2 TP57.1 ; also sheet 10
FB7: JP41.3 R338.1
GND: C314.2 C315.2 C316.2 C317.2 C318.2 C319.1 C320.1 C321.1 C322.2 C326.1 C327.1 D123.C D124.C IC37.5(REF) IC38.5(REF) Q12.2(S) R283.1 R314.1 R339.1 U$58.P$1 U$58.P$2 U$65.P$6(S3A) U$65.P$11(S3B) U$65.P$15(GND) ; also sheet 1,2,3,4,5,6,7,8,9,10,11,12,13,15,16,17,18,19,20,21,23,24,25,26,27,28,29,30,31
N$467: D116.A D117.C K12.4(2:P) R279.2 R336.1 R361.1
N$468: K12.13(3:P) R285.2
N$469: IC37.1(RG) R281.1
N$470: IC37.8(RG) R281.2
N$471: C314.1 IC36.3(+IN) R282.2
N$472: D118.A K12.16(1:-) Q12.3(D) R284.1
N$473: LED12.C R284.2
N$474: C323.1 C324.1 IC36.2(-IN) JP41.2 R314.2
N$475: C323.2 C325.2 R278.2 R279.1 R337.2 R340.1 U$57.P$3 U$57.P$4
N$476: IC37.6(OUT) R301.1
N$477: IC38.6(OUT) JP39.3 R312.1 R338.2
N$478: C324.2 C325.1 IC36.6(OUT) R280.1 R337.1
N$479: IC38.1(RG) R333.1
N$480: IC38.8(RG) R333.2
N$481: IC38.2(-IN) JP39.2
N$482: IC38.3(+IN) JP40.2
N$483: D121.C D122.A D124.A JP39.1 R334.2
N$484: R334.1 U$61.P$3 U$61.P$4
N$485: D119.C D120.A D123.A JP40.1 R335.2
N$486: R335.1 U$61.P$1 U$61.P$2
N$487: JP40.3 R336.2
N$488: JP41.1 R278.1 R285.1
N$489: R280.2 U$57.P$1 U$57.P$2
N$490: IC37.2(-IN) U$65.P$8(DA)
N$491: IC37.3(+IN) U$65.P$9(DB)
N$492: C328.2 R361.2 U$65.P$10(S4B)
N$493: C328.1 R340.2 U$65.P$7(S4A)
OUT7: K12.8(2:S) K12.9(3:S) U$58.P$3 U$58.P$4
SENSEI7: C322.1 R301.2 TP55.1 ; also sheet 8
SENSEV7: C321.2 R312.2 TP56.1 ; also sheet 8
SWITCH7: Q12.1(G) R283.2 ; also sheet 6
VCC: C316.1 C318.1 C320.2 C326.2 D116.C D118.C D120.C D122.C IC36.7(V+) IC37.7(V+) IC38.7(V+) K12.1(1:+) LED12.A U$65.P$2(EN) U$65.P$14(V+) U$65.P$16(A1) ; also sheet 1,2,3,7,8,11,13,15,16,17,18,19,20,21,23,24,25,26,27,28,29,30,31
VDD: C315.1 C317.1 C319.2 C327.2 D117.A D119.A D121.A IC36.4(V-) IC37.4(V-) IC38.4(V-) U$65.P$3(V-) ; also sheet 1,3,7,8,15,16,17,18,19,20,21,23,24,25,26,27,28,29,30,31
Unconnected: K12.6(2:O) K12.11(3:O) U$65.P$4(S1A) U$65.P$5(S2A) U$65.P$12(S2B) U$65.P$13(S1B)

## Sheet 23 of 31
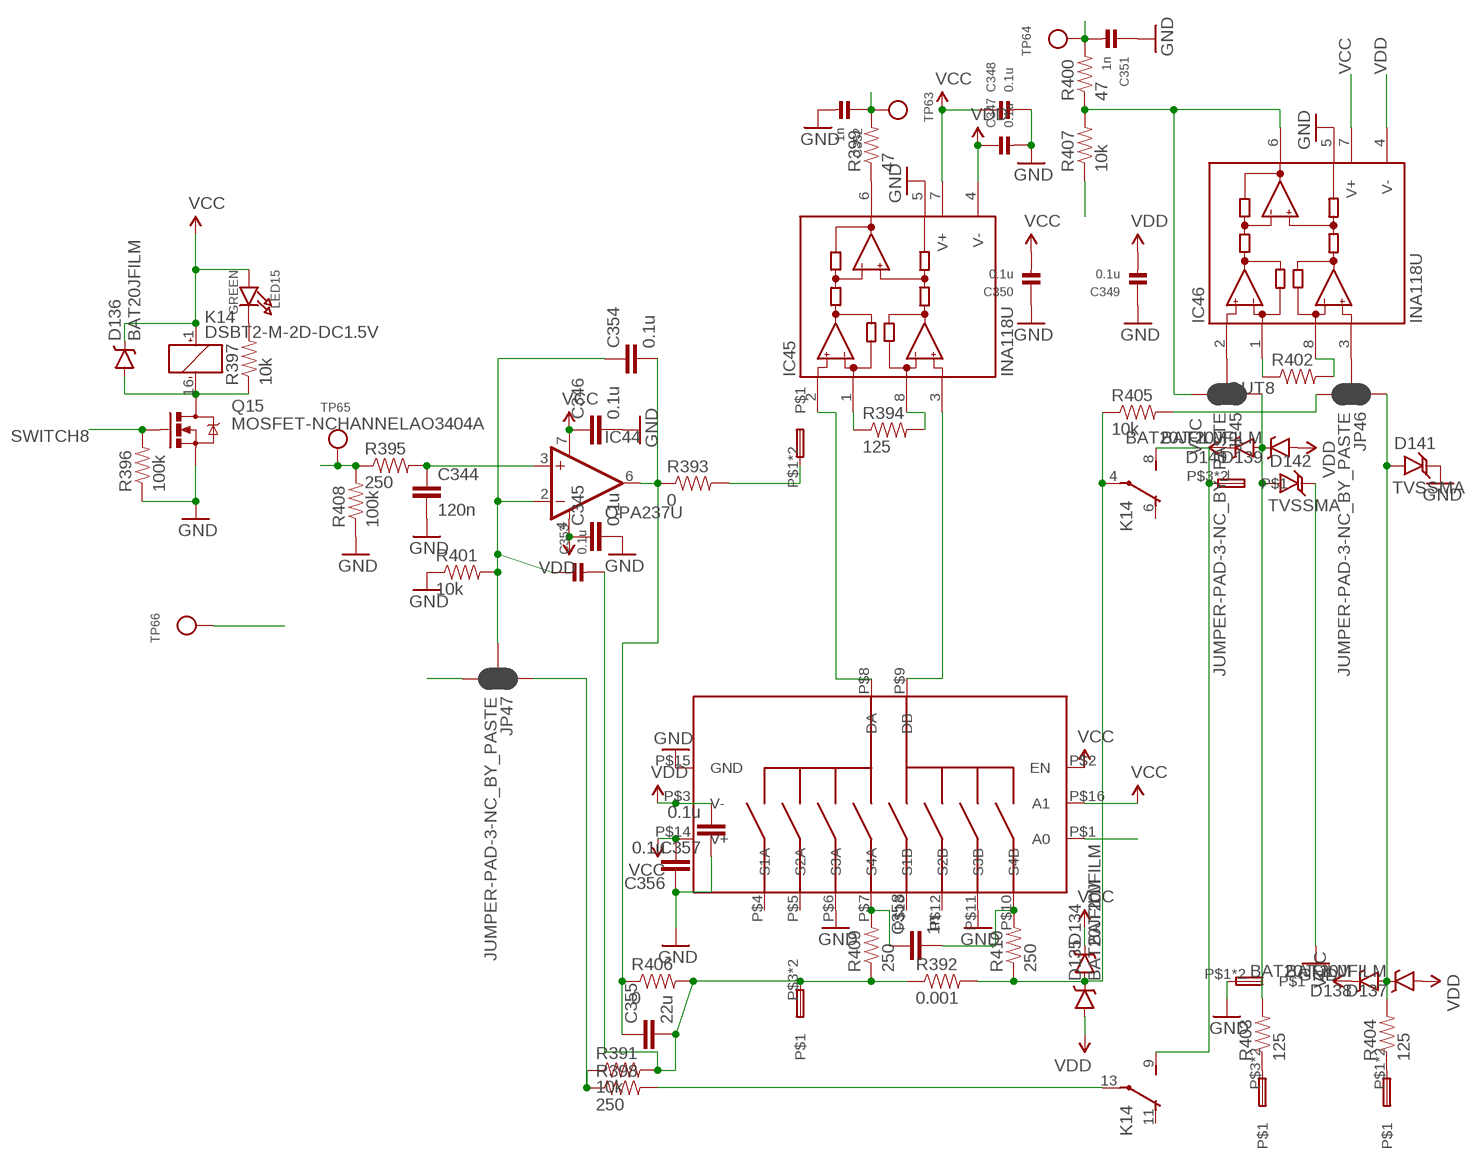
[diagram p22: schematic, sheet 23]

### Parts
C344  120n  CAP0402-CAP  [0402-CAP]
C345  0.1u  CAP0402-CAP  [0402-CAP]
C346  0.1u  CAP0402-CAP  [0402-CAP]
C347  0.1u  CAP_CERAMIC0402  [0402]
C348  0.1u  CAP_CERAMIC0402  [0402]
C349  0.1u  CAP_CERAMIC0402  [0402]
C350  0.1u  CAP_CERAMIC0402  [0402]
C351  1n  CAP_CERAMIC0402  [0402]
C352  1n  CAP_CERAMIC0402  [0402]
C353  0.1u  CAP_CERAMIC0402  [0402]
C354  0.1u  CAP0603-CAP  [0603-CAP]
C355  22u  CAP0805  [0805]
C356  0.1u  CAP0402-CAP  [0402-CAP]
C357  0.1u  CAP0402-CAP  [0402-CAP]
C358  1n  CAP0402-CAP  [0402-CAP]
D134  BAT20JFILM  [SOD-323]
D135  BAT20JFILM  [SOD-323]
D136  BAT20JFILM  [SOD-323]
D137  BAT20JFILM  [SOD-323]
D138  BAT20JFILM  [SOD-323]
D139  BAT20JFILM  [SOD-323]
D140  BAT20JFILM  [SOD-323]
D141  TVSSMA  [SMA-DIODE]
D142  TVSSMA  [SMA-DIODE]
IC44  OPA237U  [SO08]
IC45  INA118U  [SO08]
IC46  INA118U  [SO08]
JP45  JUMPER-PAD-3-NC_BY_PASTE  [PAD-JUMPER-3-NC_BY_PASTE_YES_SILK_FULL_BOX]
JP46  JUMPER-PAD-3-NC_BY_PASTE  [PAD-JUMPER-3-NC_BY_PASTE_YES_SILK_FULL_BOX]
JP47  JUMPER-PAD-3-NC_BY_PASTE  [PAD-JUMPER-3-NC_BY_PASTE_YES_SILK_FULL_BOX]
K14  DSBT2-M-2D-DC1.5V  [DS-BT]
LED15  GREEN  LED0603  [CHIPLED_0603]
Q15  MOSFET-NCHANNELAO3404A  [SOT23-3]
R391  10k  RESISTOR0402-RES  [0402-RES]
R392  0.001  0.001OHM-3W-1%(2512)3W/1%  [2512]
R393  0  RESISTOR0402-RES  [0402-RES]
R394  125  RESISTOR1206  [1206]
R395  250  RESISTOR0402-RES  [0402-RES]
R396  100k  RESISTOR0402-RES  [0402-RES]
R397  10k  RESISTOR0402-RES  [0402-RES]
R398  250  RESISTOR0402-RES  [0402-RES]
R399  47  RESISTOR0402-RES  [0402-RES]
R400  47  RESISTOR0402-RES  [0402-RES]
R401  10k  RESISTOR0402-RES  [0402-RES]
R402  RESISTOR1206  [1206]
R403  125  RESISTOR0402-RES  [0402-RES]
R404  125  RESISTOR0402-RES  [0402-RES]
R405  10k  RESISTOR0402-RES  [0402-RES]
R406  0  RESISTOR0805-RES  [0805]
R407  10k  RESISTOR0402-RES  [0402-RES]
R408  100k  RESISTOR0402-RES  [0402-RES]
R409  250  RESISTOR0402-RES  [0402-RES]
R410  250  RESISTOR0402-RES  [0402-RES]
TP63  TESTPOINT0.1"  [1X01_ROUND]
TP64  TESTPOINT0.1"  [1X01_ROUND]
TP65  TESTPOINT0.1"  [1X01_ROUND]
TP66  TESTPOINT0.1"  [1X01_ROUND]
U$71  SPTAF1/2-3.5  [SPTAF1/2-3.5]
U$72  SPTAF1/2-3.5  [SPTAF1/2-3.5]
U$73  SPTAF1/2-3.5  [SPTAF1/2-3.5]
U$74  MUX509  [R-PDSO-G16]

### Nets
A0: TP66.1 U$74.P$1(A0) ; also sheet 2,16,17,18,19,20,21,22,24,25,26,27,28,29,30,31
DAC8: R395.1 R408.2 TP65.1 ; also sheet 10
FB8: JP47.3 R407.1
GND: C344.2 C345.2 C346.2 C347.2 C348.2 C349.1 C350.1 C351.1 C352.2 C356.1 C357.1 D141.C D142.C IC45.5(REF) IC46.5(REF) Q15.2(S) R396.1 R401.1 R408.1 U$72.P$1 U$72.P$2 U$74.P$6(S3A) U$74.P$11(S3B) U$74.P$15(GND) ; also sheet 1,2,3,4,5,6,7,8,9,10,11,12,13,15,16,17,18,19,20,21,22,24,25,26,27,28,29,30,31
N$521: D134.A D135.C K14.4(2:P) R392.2 R405.1 R410.1
N$522: K14.13(3:P) R398.2
N$523: IC45.1(RG) R394.1
N$524: IC45.8(RG) R394.2
N$525: C344.1 IC44.3(+IN) R395.2
N$526: D136.A K14.16(1:-) Q15.3(D) R397.1
N$527: LED15.C R397.2
N$528: C353.1 C354.1 IC44.2(-IN) JP47.2 R401.2
N$529: C353.2 C355.2 R391.2 R392.1 R406.2 R409.1 U$71.P$3 U$71.P$4
N$530: IC45.6(OUT) R399.1
N$531: IC46.6(OUT) JP45.3 R400.1 R407.2
N$532: C354.2 C355.1 IC44.6(OUT) R393.1 R406.1
N$533: IC46.1(RG) R402.1
N$534: IC46.8(RG) R402.2
N$535: IC46.2(-IN) JP45.2
N$536: IC46.3(+IN) JP46.2
N$537: D139.C D140.A D142.A JP45.1 R403.2
N$538: R403.1 U$73.P$3 U$73.P$4
N$539: D137.C D138.A D141.A JP46.1 R404.2
N$540: R404.1 U$73.P$1 U$73.P$2
N$541: JP46.3 R405.2
N$542: JP47.1 R391.1 R398.1
N$543: R393.2 U$71.P$1 U$71.P$2
N$544: IC45.2(-IN) U$74.P$8(DA)
N$545: IC45.3(+IN) U$74.P$9(DB)
N$546: C358.2 R410.2 U$74.P$10(S4B)
N$547: C358.1 R409.2 U$74.P$7(S4A)
OUT8: K14.8(2:S) K14.9(3:S) U$72.P$3 U$72.P$4
SENSEI8: C352.1 R399.2 TP63.1 ; also sheet 8
SENSEV8: C351.2 R400.2 TP64.1 ; also sheet 8
SWITCH8: Q15.1(G) R396.2 ; also sheet 6
VCC: C346.1 C348.1 C350.2 C356.2 D134.C D136.C D138.C D140.C IC44.7(V+) IC45.7(V+) IC46.7(V+) K14.1(1:+) LED15.A U$74.P$2(EN) U$74.P$14(V+) U$74.P$16(A1) ; also sheet 1,2,3,7,8,11,13,15,16,17,18,19,20,21,22,24,25,26,27,28,29,30,31
VDD: C345.1 C347.1 C349.2 C357.2 D135.A D137.A D139.A IC44.4(V-) IC45.4(V-) IC46.4(V-) U$74.P$3(V-) ; also sheet 1,3,7,8,15,16,17,18,19,20,21,22,24,25,26,27,28,29,30,31
Unconnected: K14.6(2:O) K14.11(3:O) U$74.P$4(S1A) U$74.P$5(S2A) U$74.P$12(S2B) U$74.P$13(S1B)

## Sheet 24 of 31
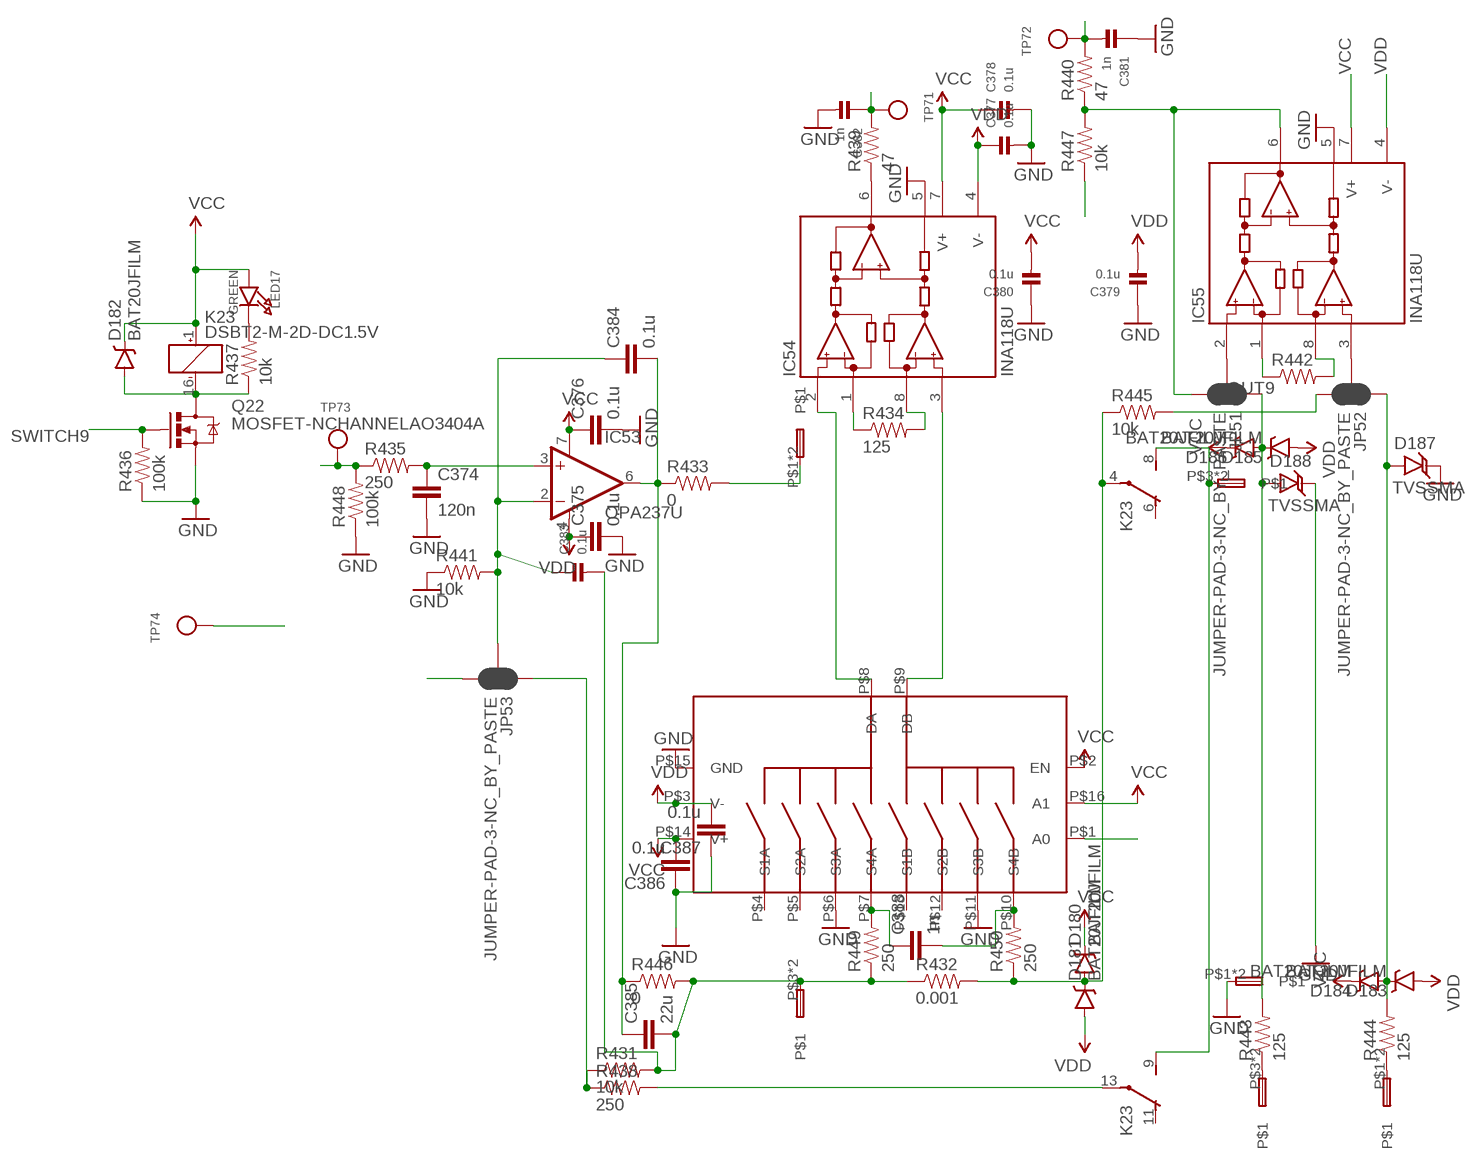
[diagram p23: schematic, sheet 24]

### Parts
C374  120n  CAP0402-CAP  [0402-CAP]
C375  0.1u  CAP0402-CAP  [0402-CAP]
C376  0.1u  CAP0402-CAP  [0402-CAP]
C377  0.1u  CAP_CERAMIC0402  [0402]
C378  0.1u  CAP_CERAMIC0402  [0402]
C379  0.1u  CAP_CERAMIC0402  [0402]
C380  0.1u  CAP_CERAMIC0402  [0402]
C381  1n  CAP_CERAMIC0402  [0402]
C382  1n  CAP_CERAMIC0402  [0402]
C383  0.1u  CAP_CERAMIC0402  [0402]
C384  0.1u  CAP0603-CAP  [0603-CAP]
C385  22u  CAP0805  [0805]
C386  0.1u  CAP0402-CAP  [0402-CAP]
C387  0.1u  CAP0402-CAP  [0402-CAP]
C388  1n  CAP0402-CAP  [0402-CAP]
D180  BAT20JFILM  [SOD-323]
D181  BAT20JFILM  [SOD-323]
D182  BAT20JFILM  [SOD-323]
D183  BAT20JFILM  [SOD-323]
D184  BAT20JFILM  [SOD-323]
D185  BAT20JFILM  [SOD-323]
D186  BAT20JFILM  [SOD-323]
D187  TVSSMA  [SMA-DIODE]
D188  TVSSMA  [SMA-DIODE]
IC53  OPA237U  [SO08]
IC54  INA118U  [SO08]
IC55  INA118U  [SO08]
JP51  JUMPER-PAD-3-NC_BY_PASTE  [PAD-JUMPER-3-NC_BY_PASTE_YES_SILK_FULL_BOX]
JP52  JUMPER-PAD-3-NC_BY_PASTE  [PAD-JUMPER-3-NC_BY_PASTE_YES_SILK_FULL_BOX]
JP53  JUMPER-PAD-3-NC_BY_PASTE  [PAD-JUMPER-3-NC_BY_PASTE_YES_SILK_FULL_BOX]
K23  DSBT2-M-2D-DC1.5V  [DS-BT]
LED17  GREEN  LED0603  [CHIPLED_0603]
Q22  MOSFET-NCHANNELAO3404A  [SOT23-3]
R431  10k  RESISTOR0402-RES  [0402-RES]
R432  0.001  0.001OHM-3W-1%(2512)3W/1%  [2512]
R433  0  RESISTOR0402-RES  [0402-RES]
R434  125  RESISTOR1206  [1206]
R435  250  RESISTOR0402-RES  [0402-RES]
R436  100k  RESISTOR0402-RES  [0402-RES]
R437  10k  RESISTOR0402-RES  [0402-RES]
R438  250  RESISTOR0402-RES  [0402-RES]
R439  47  RESISTOR0402-RES  [0402-RES]
R440  47  RESISTOR0402-RES  [0402-RES]
R441  10k  RESISTOR0402-RES  [0402-RES]
R442  RESISTOR1206  [1206]
R443  125  RESISTOR0402-RES  [0402-RES]
R444  125  RESISTOR0402-RES  [0402-RES]
R445  10k  RESISTOR0402-RES  [0402-RES]
R446  0  RESISTOR0805-RES  [0805]
R447  10k  RESISTOR0402-RES  [0402-RES]
R448  100k  RESISTOR0402-RES  [0402-RES]
R449  250  RESISTOR0402-RES  [0402-RES]
R450  250  RESISTOR0402-RES  [0402-RES]
TP71  TESTPOINT0.1"  [1X01_ROUND]
TP72  TESTPOINT0.1"  [1X01_ROUND]
TP73  TESTPOINT0.1"  [1X01_ROUND]
TP74  TESTPOINT0.1"  [1X01_ROUND]
U$79  SPTAF1/2-3.5  [SPTAF1/2-3.5]
U$80  SPTAF1/2-3.5  [SPTAF1/2-3.5]
U$81  SPTAF1/2-3.5  [SPTAF1/2-3.5]
U$82  MUX509  [R-PDSO-G16]

### Nets
A0: TP74.1 U$82.P$1(A0) ; also sheet 2,16,17,18,19,20,21,22,23,25,26,27,28,29,30,31
DAC9: R435.1 R448.2 TP73.1 ; also sheet 9
FB9: JP53.3 R447.1
GND: C374.2 C375.2 C376.2 C377.2 C378.2 C379.1 C380.1 C381.1 C382.2 C386.1 C387.1 D187.C D188.C IC54.5(REF) IC55.5(REF) Q22.2(S) R436.1 R441.1 R448.1 U$80.P$1 U$80.P$2 U$82.P$6(S3A) U$82.P$11(S3B) U$82.P$15(GND) ; also sheet 1,2,3,4,5,6,7,8,9,10,11,12,13,15,16,17,18,19,20,21,22,23,25,26,27,28,29,30,31
N$575: D180.A D181.C K23.4(2:P) R432.2 R445.1 R450.1
N$576: K23.13(3:P) R438.2
N$577: IC54.1(RG) R434.1
N$578: IC54.8(RG) R434.2
N$579: C374.1 IC53.3(+IN) R435.2
N$580: D182.A K23.16(1:-) Q22.3(D) R437.1
N$581: LED17.C R437.2
N$582: C383.1 C384.1 IC53.2(-IN) JP53.2 R441.2
N$583: C383.2 C385.2 R431.2 R432.1 R446.2 R449.1 U$79.P$3 U$79.P$4
N$584: IC54.6(OUT) R439.1
N$585: IC55.6(OUT) JP51.3 R440.1 R447.2
N$586: C384.2 C385.1 IC53.6(OUT) R433.1 R446.1
N$587: IC55.1(RG) R442.1
N$588: IC55.8(RG) R442.2
N$589: IC55.2(-IN) JP51.2
N$590: IC55.3(+IN) JP52.2
N$591: D185.C D186.A D188.A JP51.1 R443.2
N$592: R443.1 U$81.P$3 U$81.P$4
N$593: D183.C D184.A D187.A JP52.1 R444.2
N$594: R444.1 U$81.P$1 U$81.P$2
N$595: JP52.3 R445.2
N$596: JP53.1 R431.1 R438.1
N$597: R433.2 U$79.P$1 U$79.P$2
N$598: IC54.2(-IN) U$82.P$8(DA)
N$599: IC54.3(+IN) U$82.P$9(DB)
N$600: C388.2 R450.2 U$82.P$10(S4B)
N$601: C388.1 R449.2 U$82.P$7(S4A)
OUT9: K23.8(2:S) K23.9(3:S) U$80.P$3 U$80.P$4
SENSEI9: C382.1 R439.2 TP71.1 ; also sheet 7
SENSEV9: C381.2 R440.2 TP72.1 ; also sheet 7
SWITCH9: Q22.1(G) R436.2 ; also sheet 6
VCC: C376.1 C378.1 C380.2 C386.2 D180.C D182.C D184.C D186.C IC53.7(V+) IC54.7(V+) IC55.7(V+) K23.1(1:+) LED17.A U$82.P$2(EN) U$82.P$14(V+) U$82.P$16(A1) ; also sheet 1,2,3,7,8,11,13,15,16,17,18,19,20,21,22,23,25,26,27,28,29,30,31
VDD: C375.1 C377.1 C379.2 C387.2 D181.A D183.A D185.A IC53.4(V-) IC54.4(V-) IC55.4(V-) U$82.P$3(V-) ; also sheet 1,3,7,8,15,16,17,18,19,20,21,22,23,25,26,27,28,29,30,31
Unconnected: K23.6(2:O) K23.11(3:O) U$82.P$4(S1A) U$82.P$5(S2A) U$82.P$12(S2B) U$82.P$13(S1B)

## Sheet 25 of 31
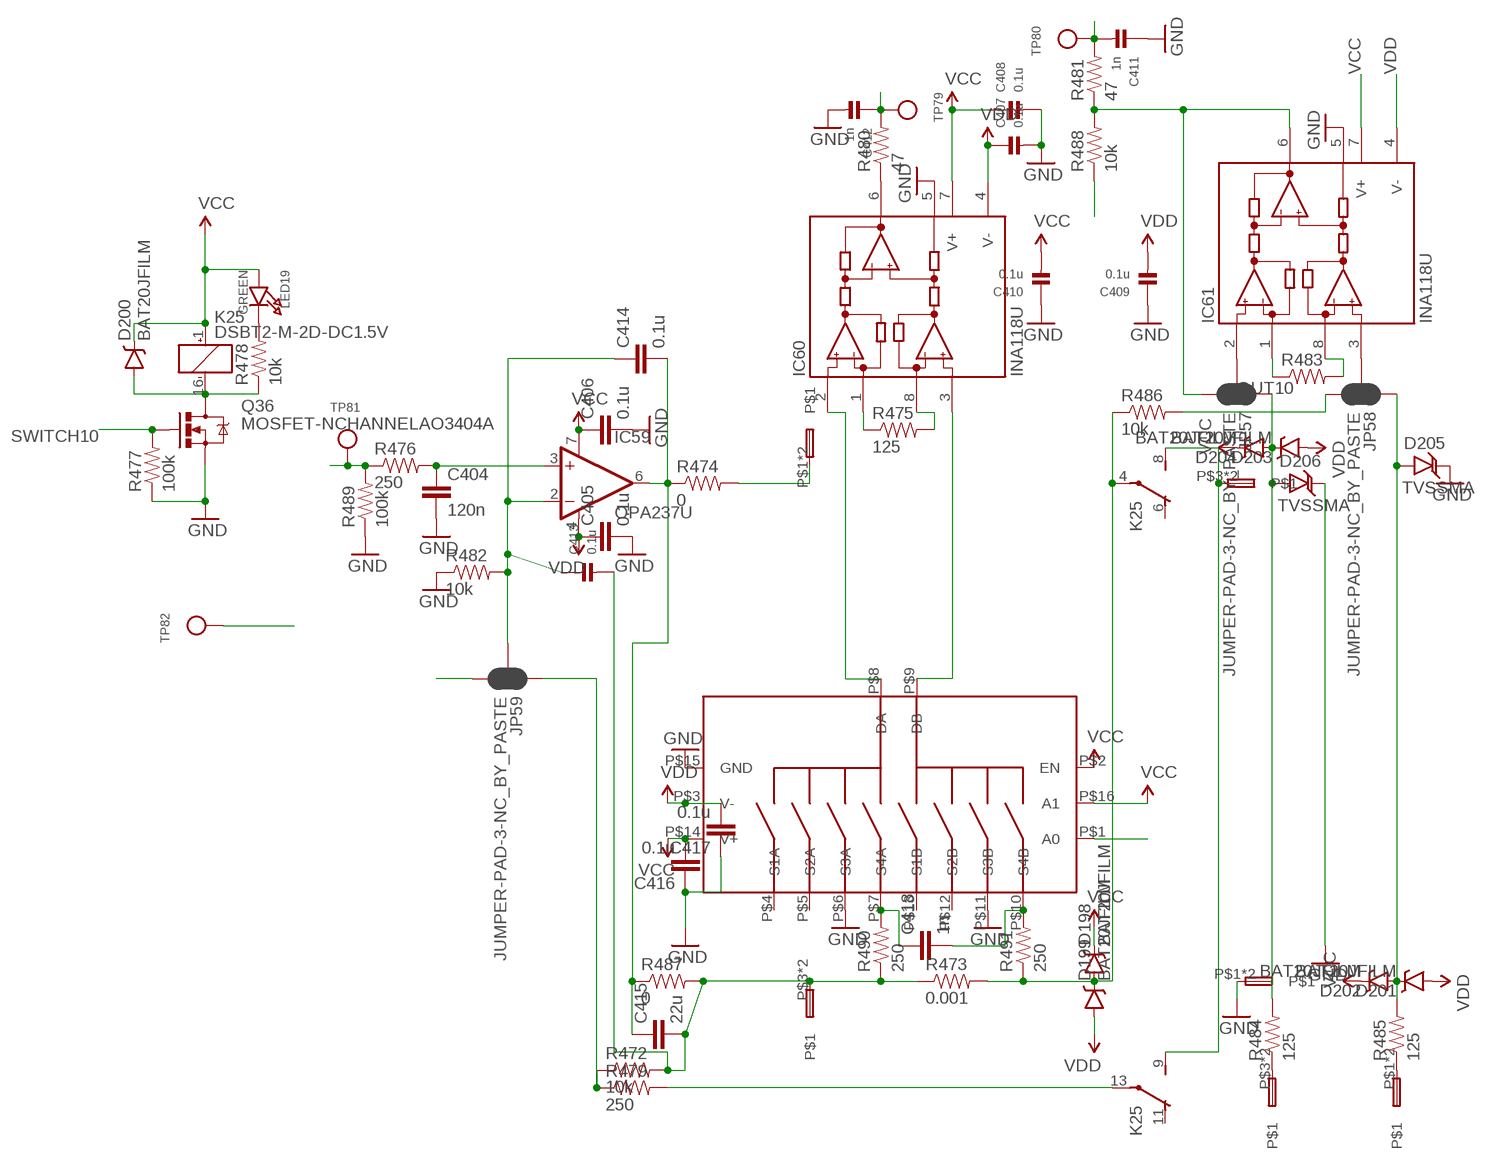
[diagram p24: schematic, sheet 25]

### Parts
C404  120n  CAP0402-CAP  [0402-CAP]
C405  0.1u  CAP0402-CAP  [0402-CAP]
C406  0.1u  CAP0402-CAP  [0402-CAP]
C407  0.1u  CAP_CERAMIC0402  [0402]
C408  0.1u  CAP_CERAMIC0402  [0402]
C409  0.1u  CAP_CERAMIC0402  [0402]
C410  0.1u  CAP_CERAMIC0402  [0402]
C411  1n  CAP_CERAMIC0402  [0402]
C412  1n  CAP_CERAMIC0402  [0402]
C413  0.1u  CAP_CERAMIC0402  [0402]
C414  0.1u  CAP0603-CAP  [0603-CAP]
C415  22u  CAP0805  [0805]
C416  0.1u  CAP0402-CAP  [0402-CAP]
C417  0.1u  CAP0402-CAP  [0402-CAP]
C418  1n  CAP0402-CAP  [0402-CAP]
D198  BAT20JFILM  [SOD-323]
D199  BAT20JFILM  [SOD-323]
D200  BAT20JFILM  [SOD-323]
D201  BAT20JFILM  [SOD-323]
D202  BAT20JFILM  [SOD-323]
D203  BAT20JFILM  [SOD-323]
D204  BAT20JFILM  [SOD-323]
D205  TVSSMA  [SMA-DIODE]
D206  TVSSMA  [SMA-DIODE]
IC59  OPA237U  [SO08]
IC60  INA118U  [SO08]
IC61  INA118U  [SO08]
JP57  JUMPER-PAD-3-NC_BY_PASTE  [PAD-JUMPER-3-NC_BY_PASTE_YES_SILK_FULL_BOX]
JP58  JUMPER-PAD-3-NC_BY_PASTE  [PAD-JUMPER-3-NC_BY_PASTE_YES_SILK_FULL_BOX]
JP59  JUMPER-PAD-3-NC_BY_PASTE  [PAD-JUMPER-3-NC_BY_PASTE_YES_SILK_FULL_BOX]
K25  DSBT2-M-2D-DC1.5V  [DS-BT]
LED19  GREEN  LED0603  [CHIPLED_0603]
Q36  MOSFET-NCHANNELAO3404A  [SOT23-3]
R472  10k  RESISTOR0402-RES  [0402-RES]
R473  0.001  0.001OHM-3W-1%(2512)3W/1%  [2512]
R474  0  RESISTOR0402-RES  [0402-RES]
R475  125  RESISTOR1206  [1206]
R476  250  RESISTOR0402-RES  [0402-RES]
R477  100k  RESISTOR0402-RES  [0402-RES]
R478  10k  RESISTOR0402-RES  [0402-RES]
R479  250  RESISTOR0402-RES  [0402-RES]
R480  47  RESISTOR0402-RES  [0402-RES]
R481  47  RESISTOR0402-RES  [0402-RES]
R482  10k  RESISTOR0402-RES  [0402-RES]
R483  RESISTOR1206  [1206]
R484  125  RESISTOR0402-RES  [0402-RES]
R485  125  RESISTOR0402-RES  [0402-RES]
R486  10k  RESISTOR0402-RES  [0402-RES]
R487  0  RESISTOR0805-RES  [0805]
R488  10k  RESISTOR0402-RES  [0402-RES]
R489  100k  RESISTOR0402-RES  [0402-RES]
R490  250  RESISTOR0402-RES  [0402-RES]
R491  250  RESISTOR0402-RES  [0402-RES]
TP79  TESTPOINT0.1"  [1X01_ROUND]
TP80  TESTPOINT0.1"  [1X01_ROUND]
TP81  TESTPOINT0.1"  [1X01_ROUND]
TP82  TESTPOINT0.1"  [1X01_ROUND]
U$87  SPTAF1/2-3.5  [SPTAF1/2-3.5]
U$88  SPTAF1/2-3.5  [SPTAF1/2-3.5]
U$89  SPTAF1/2-3.5  [SPTAF1/2-3.5]
U$90  MUX509  [R-PDSO-G16]

### Nets
A0: TP82.1 U$90.P$1(A0) ; also sheet 2,16,17,18,19,20,21,22,23,24,26,27,28,29,30,31
DAC10: R476.1 R489.2 TP81.1 ; also sheet 9
FB10: JP59.3 R488.1
GND: C404.2 C405.2 C406.2 C407.2 C408.2 C409.1 C410.1 C411.1 C412.2 C416.1 C417.1 D205.C D206.C IC60.5(REF) IC61.5(REF) Q36.2(S) R477.1 R482.1 R489.1 U$88.P$1 U$88.P$2 U$90.P$6(S3A) U$90.P$11(S3B) U$90.P$15(GND) ; also sheet 1,2,3,4,5,6,7,8,9,10,11,12,13,15,16,17,18,19,20,21,22,23,24,26,27,28,29,30,31
N$629: D198.A D199.C K25.4(2:P) R473.2 R486.1 R491.1
N$630: K25.13(3:P) R479.2
N$631: IC60.1(RG) R475.1
N$632: IC60.8(RG) R475.2
N$633: C404.1 IC59.3(+IN) R476.2
N$634: D200.A K25.16(1:-) Q36.3(D) R478.1
N$635: LED19.C R478.2
N$636: C413.1 C414.1 IC59.2(-IN) JP59.2 R482.2
N$637: C413.2 C415.2 R472.2 R473.1 R487.2 R490.1 U$87.P$3 U$87.P$4
N$638: IC60.6(OUT) R480.1
N$639: IC61.6(OUT) JP57.3 R481.1 R488.2
N$640: C414.2 C415.1 IC59.6(OUT) R474.1 R487.1
N$641: IC61.1(RG) R483.1
N$642: IC61.8(RG) R483.2
N$643: IC61.2(-IN) JP57.2
N$644: IC61.3(+IN) JP58.2
N$645: D203.C D204.A D206.A JP57.1 R484.2
N$646: R484.1 U$89.P$3 U$89.P$4
N$647: D201.C D202.A D205.A JP58.1 R485.2
N$648: R485.1 U$89.P$1 U$89.P$2
N$649: JP58.3 R486.2
N$650: JP59.1 R472.1 R479.1
N$651: R474.2 U$87.P$1 U$87.P$2
N$652: IC60.2(-IN) U$90.P$8(DA)
N$653: IC60.3(+IN) U$90.P$9(DB)
N$654: C418.2 R491.2 U$90.P$10(S4B)
N$655: C418.1 R490.2 U$90.P$7(S4A)
OUT10: K25.8(2:S) K25.9(3:S) U$88.P$3 U$88.P$4
SENSEI10: C412.1 R480.2 TP79.1 ; also sheet 7
SENSEV10: C411.2 R481.2 TP80.1 ; also sheet 7
SWITCH10: Q36.1(G) R477.2 ; also sheet 6
VCC: C406.1 C408.1 C410.2 C416.2 D198.C D200.C D202.C D204.C IC59.7(V+) IC60.7(V+) IC61.7(V+) K25.1(1:+) LED19.A U$90.P$2(EN) U$90.P$14(V+) U$90.P$16(A1) ; also sheet 1,2,3,7,8,11,13,15,16,17,18,19,20,21,22,23,24,26,27,28,29,30,31
VDD: C405.1 C407.1 C409.2 C417.2 D199.A D201.A D203.A IC59.4(V-) IC60.4(V-) IC61.4(V-) U$90.P$3(V-) ; also sheet 1,3,7,8,15,16,17,18,19,20,21,22,23,24,26,27,28,29,30,31
Unconnected: K25.6(2:O) K25.11(3:O) U$90.P$4(S1A) U$90.P$5(S2A) U$90.P$12(S2B) U$90.P$13(S1B)

## Sheet 26 of 31
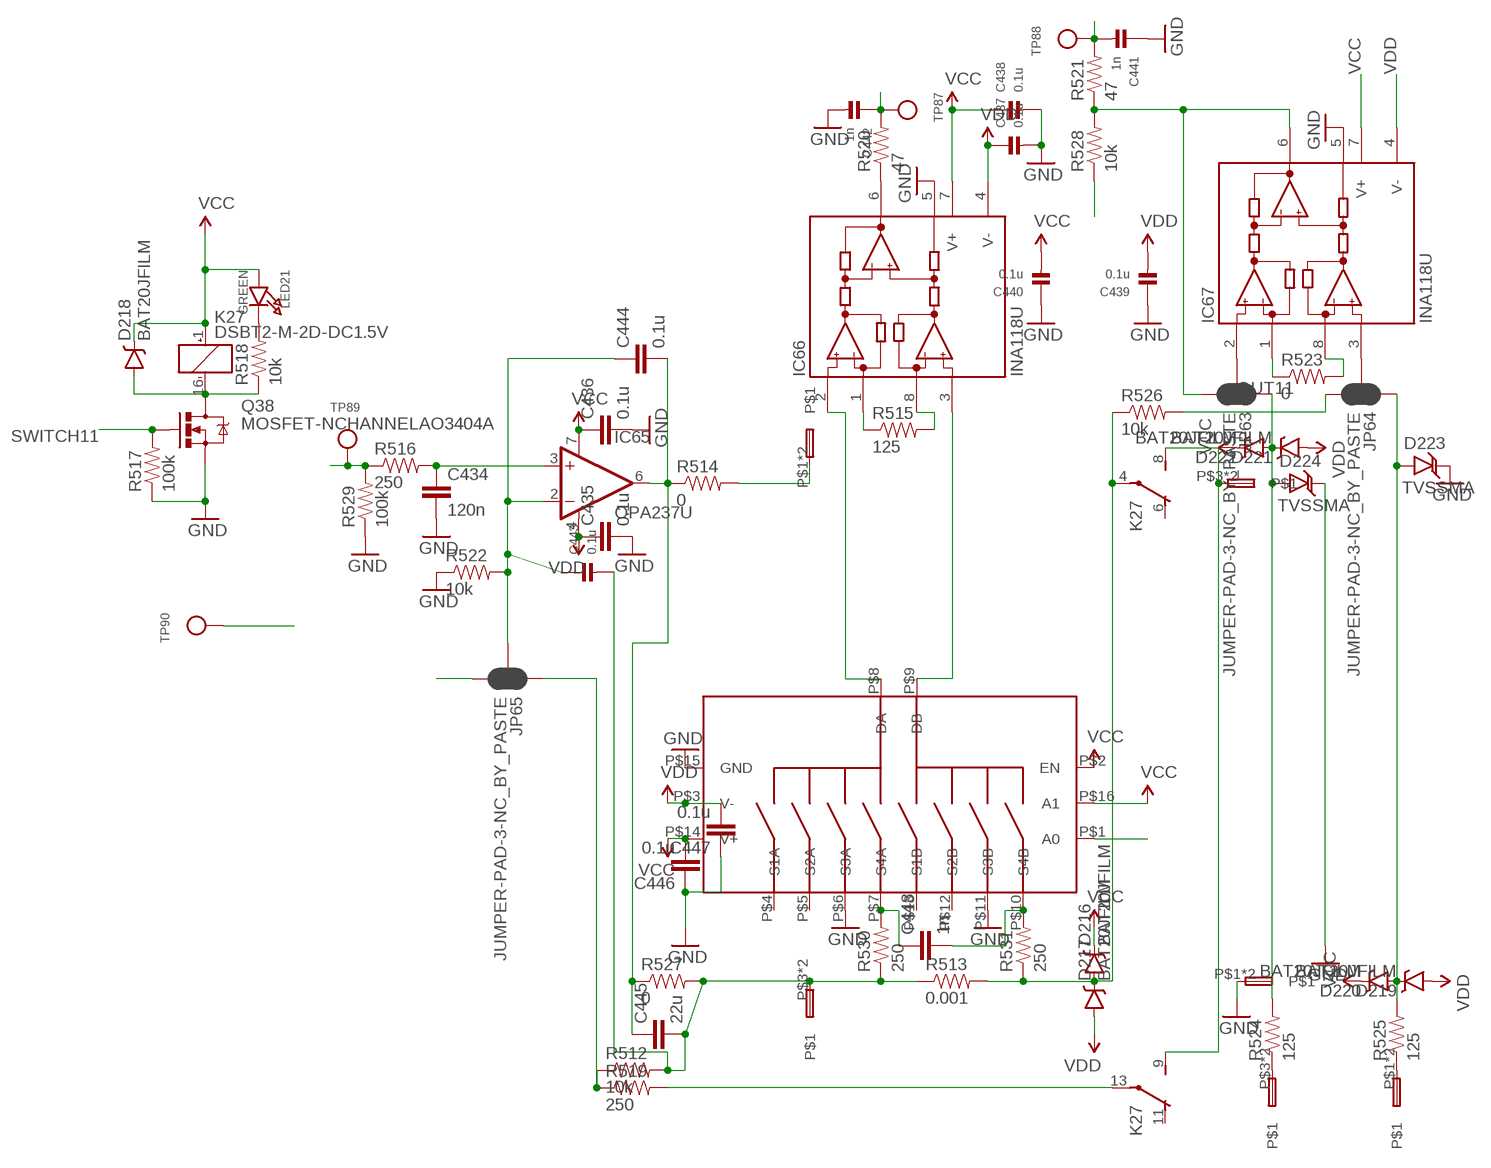
[diagram p25: schematic, sheet 26]

### Parts
C434  120n  CAP0402-CAP  [0402-CAP]
C435  0.1u  CAP0402-CAP  [0402-CAP]
C436  0.1u  CAP0402-CAP  [0402-CAP]
C437  0.1u  CAP_CERAMIC0402  [0402]
C438  0.1u  CAP_CERAMIC0402  [0402]
C439  0.1u  CAP_CERAMIC0402  [0402]
C440  0.1u  CAP_CERAMIC0402  [0402]
C441  1n  CAP_CERAMIC0402  [0402]
C442  1n  CAP_CERAMIC0402  [0402]
C443  0.1u  CAP_CERAMIC0402  [0402]
C444  0.1u  CAP0603-CAP  [0603-CAP]
C445  22u  CAP0805  [0805]
C446  0.1u  CAP0402-CAP  [0402-CAP]
C447  0.1u  CAP0402-CAP  [0402-CAP]
C448  1n  CAP0402-CAP  [0402-CAP]
D216  BAT20JFILM  [SOD-323]
D217  BAT20JFILM  [SOD-323]
D218  BAT20JFILM  [SOD-323]
D219  BAT20JFILM  [SOD-323]
D220  BAT20JFILM  [SOD-323]
D221  BAT20JFILM  [SOD-323]
D222  BAT20JFILM  [SOD-323]
D223  TVSSMA  [SMA-DIODE]
D224  TVSSMA  [SMA-DIODE]
IC65  OPA237U  [SO08]
IC66  INA118U  [SO08]
IC67  INA118U  [SO08]
JP63  JUMPER-PAD-3-NC_BY_PASTE  [PAD-JUMPER-3-NC_BY_PASTE_YES_SILK_FULL_BOX]
JP64  JUMPER-PAD-3-NC_BY_PASTE  [PAD-JUMPER-3-NC_BY_PASTE_YES_SILK_FULL_BOX]
JP65  JUMPER-PAD-3-NC_BY_PASTE  [PAD-JUMPER-3-NC_BY_PASTE_YES_SILK_FULL_BOX]
K27  DSBT2-M-2D-DC1.5V  [DS-BT]
LED21  GREEN  LED0603  [CHIPLED_0603]
Q38  MOSFET-NCHANNELAO3404A  [SOT23-3]
R512  10k  RESISTOR0402-RES  [0402-RES]
R513  0.001  0.001OHM-3W-1%(2512)3W/1%  [2512]
R514  0  RESISTOR0402-RES  [0402-RES]
R515  125  RESISTOR1206  [1206]
R516  250  RESISTOR0402-RES  [0402-RES]
R517  100k  RESISTOR0402-RES  [0402-RES]
R518  10k  RESISTOR0402-RES  [0402-RES]
R519  250  RESISTOR0402-RES  [0402-RES]
R520  47  RESISTOR0402-RES  [0402-RES]
R521  47  RESISTOR0402-RES  [0402-RES]
R522  10k  RESISTOR0402-RES  [0402-RES]
R523  0  RESISTOR1206  [1206]
R524  125  RESISTOR0402-RES  [0402-RES]
R525  125  RESISTOR0402-RES  [0402-RES]
R526  10k  RESISTOR0402-RES  [0402-RES]
R527  0  RESISTOR0805-RES  [0805]
R528  10k  RESISTOR0402-RES  [0402-RES]
R529  100k  RESISTOR0402-RES  [0402-RES]
R530  250  RESISTOR0402-RES  [0402-RES]
R531  250  RESISTOR0402-RES  [0402-RES]
TP87  TESTPOINT0.1"  [1X01_ROUND]
TP88  TESTPOINT0.1"  [1X01_ROUND]
TP89  TESTPOINT0.1"  [1X01_ROUND]
TP90  TESTPOINT0.1"  [1X01_ROUND]
U$95  SPTAF1/2-3.5  [SPTAF1/2-3.5]
U$96  SPTAF1/2-3.5  [SPTAF1/2-3.5]
U$97  SPTAF1/2-3.5  [SPTAF1/2-3.5]
U$98  MUX509  [R-PDSO-G16]

### Nets
A0: TP90.1 U$98.P$1(A0) ; also sheet 2,16,17,18,19,20,21,22,23,24,25,27,28,29,30,31
DAC11: R516.1 R529.2 TP89.1 ; also sheet 9
FB11: JP65.3 R528.1
GND: C434.2 C435.2 C436.2 C437.2 C438.2 C439.1 C440.1 C441.1 C442.2 C446.1 C447.1 D223.C D224.C IC66.5(REF) IC67.5(REF) Q38.2(S) R517.1 R522.1 R529.1 U$96.P$1 U$96.P$2 U$98.P$6(S3A) U$98.P$11(S3B) U$98.P$15(GND) ; also sheet 1,2,3,4,5,6,7,8,9,10,11,12,13,15,16,17,18,19,20,21,22,23,24,25,27,28,29,30,31
N$683: D216.A D217.C K27.4(2:P) R513.2 R526.1 R531.1
N$684: K27.13(3:P) R519.2
N$685: IC66.1(RG) R515.1
N$686: IC66.8(RG) R515.2
N$687: C434.1 IC65.3(+IN) R516.2
N$688: D218.A K27.16(1:-) Q38.3(D) R518.1
N$689: LED21.C R518.2
N$690: C443.1 C444.1 IC65.2(-IN) JP65.2 R522.2
N$691: C443.2 C445.2 R512.2 R513.1 R527.2 R530.1 U$95.P$3 U$95.P$4
N$692: IC66.6(OUT) R520.1
N$693: IC67.6(OUT) JP63.3 R521.1 R528.2
N$694: C444.2 C445.1 IC65.6(OUT) R514.1 R527.1
N$695: IC67.1(RG) R523.1
N$696: IC67.8(RG) R523.2
N$697: IC67.2(-IN) JP63.2
N$698: IC67.3(+IN) JP64.2
N$699: D221.C D222.A D224.A JP63.1 R524.2
N$700: R524.1 U$97.P$3 U$97.P$4
N$701: D219.C D220.A D223.A JP64.1 R525.2
N$702: R525.1 U$97.P$1 U$97.P$2
N$703: JP64.3 R526.2
N$704: JP65.1 R512.1 R519.1
N$705: R514.2 U$95.P$1 U$95.P$2
N$706: IC66.2(-IN) U$98.P$8(DA)
N$707: IC66.3(+IN) U$98.P$9(DB)
N$708: C448.2 R531.2 U$98.P$10(S4B)
N$709: C448.1 R530.2 U$98.P$7(S4A)
OUT11: K27.8(2:S) K27.9(3:S) U$96.P$3 U$96.P$4
SENSEI11: C442.1 R520.2 TP87.1 ; also sheet 7
SENSEV11: C441.2 R521.2 TP88.1 ; also sheet 7
SWITCH11: Q38.1(G) R517.2 ; also sheet 6
VCC: C436.1 C438.1 C440.2 C446.2 D216.C D218.C D220.C D222.C IC65.7(V+) IC66.7(V+) IC67.7(V+) K27.1(1:+) LED21.A U$98.P$2(EN) U$98.P$14(V+) U$98.P$16(A1) ; also sheet 1,2,3,7,8,11,13,15,16,17,18,19,20,21,22,23,24,25,27,28,29,30,31
VDD: C435.1 C437.1 C439.2 C447.2 D217.A D219.A D221.A IC65.4(V-) IC66.4(V-) IC67.4(V-) U$98.P$3(V-) ; also sheet 1,3,7,8,15,16,17,18,19,20,21,22,23,24,25,27,28,29,30,31
Unconnected: K27.6(2:O) K27.11(3:O) U$98.P$4(S1A) U$98.P$5(S2A) U$98.P$12(S2B) U$98.P$13(S1B)

## Sheet 27 of 31
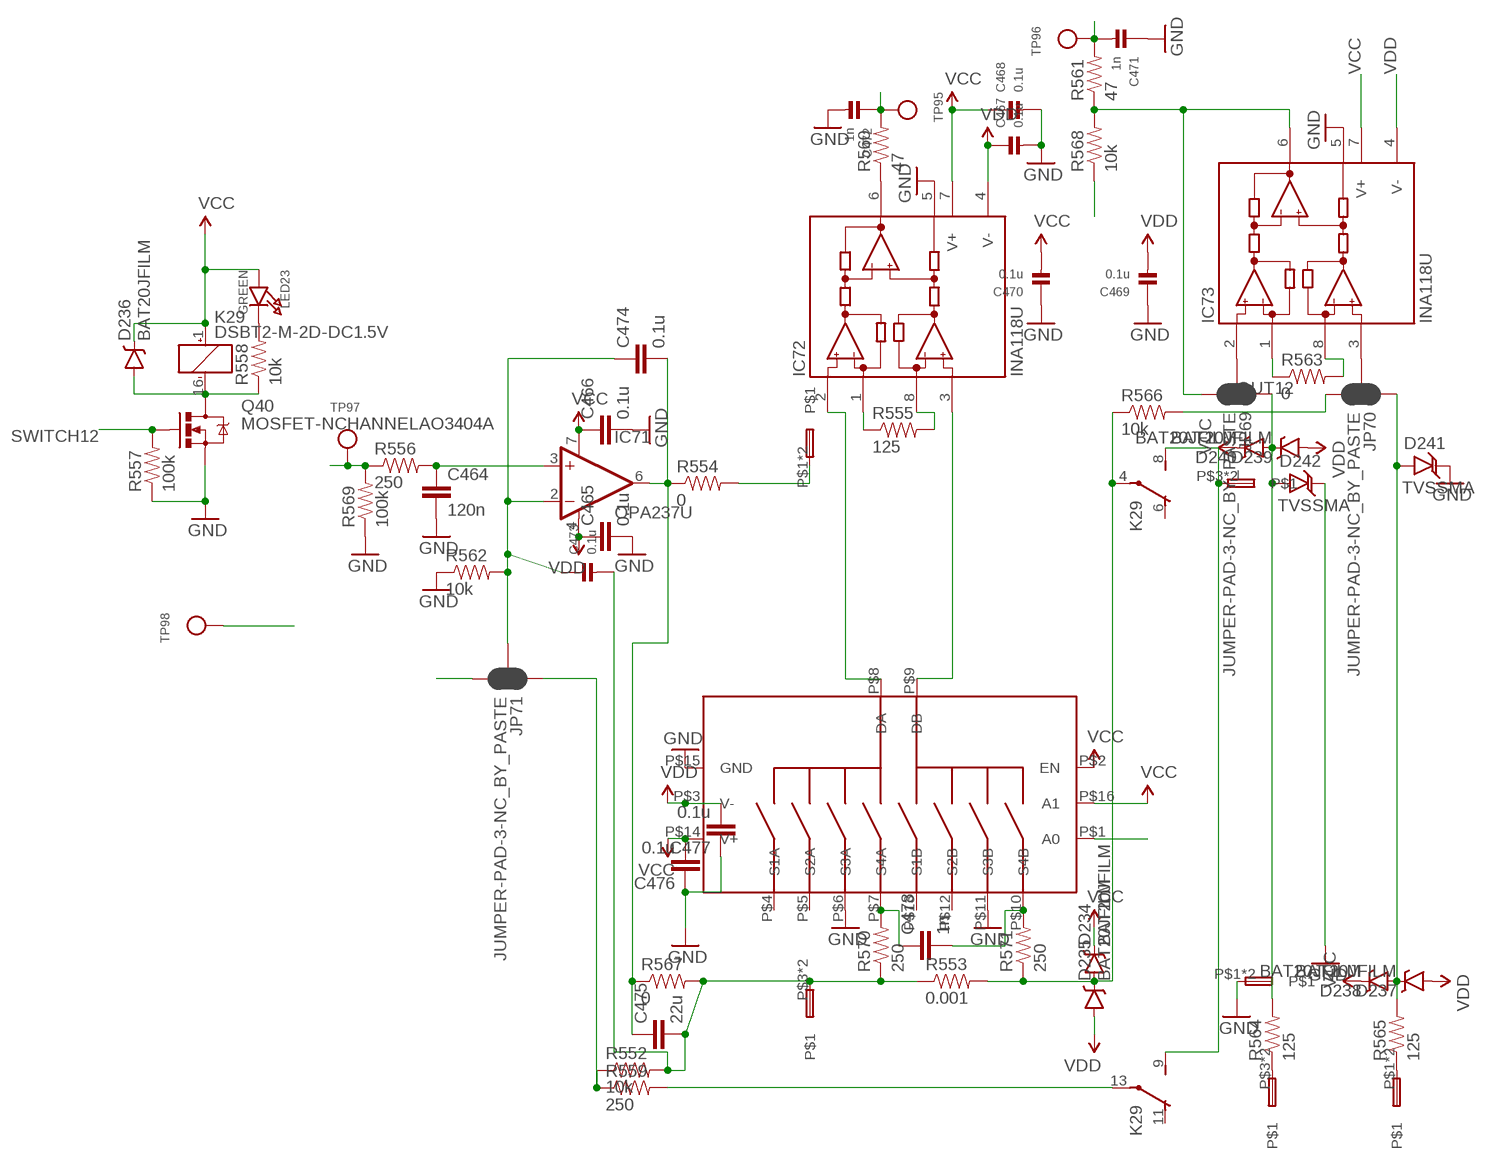
[diagram p26: schematic, sheet 27]

### Parts
C464  120n  CAP0402-CAP  [0402-CAP]
C465  0.1u  CAP0402-CAP  [0402-CAP]
C466  0.1u  CAP0402-CAP  [0402-CAP]
C467  0.1u  CAP_CERAMIC0402  [0402]
C468  0.1u  CAP_CERAMIC0402  [0402]
C469  0.1u  CAP_CERAMIC0402  [0402]
C470  0.1u  CAP_CERAMIC0402  [0402]
C471  1n  CAP_CERAMIC0402  [0402]
C472  1n  CAP_CERAMIC0402  [0402]
C473  0.1u  CAP_CERAMIC0402  [0402]
C474  0.1u  CAP0603-CAP  [0603-CAP]
C475  22u  CAP0805  [0805]
C476  0.1u  CAP0402-CAP  [0402-CAP]
C477  0.1u  CAP0402-CAP  [0402-CAP]
C478  1n  CAP0402-CAP  [0402-CAP]
D234  BAT20JFILM  [SOD-323]
D235  BAT20JFILM  [SOD-323]
D236  BAT20JFILM  [SOD-323]
D237  BAT20JFILM  [SOD-323]
D238  BAT20JFILM  [SOD-323]
D239  BAT20JFILM  [SOD-323]
D240  BAT20JFILM  [SOD-323]
D241  TVSSMA  [SMA-DIODE]
D242  TVSSMA  [SMA-DIODE]
IC71  OPA237U  [SO08]
IC72  INA118U  [SO08]
IC73  INA118U  [SO08]
JP69  JUMPER-PAD-3-NC_BY_PASTE  [PAD-JUMPER-3-NC_BY_PASTE_YES_SILK_FULL_BOX]
JP70  JUMPER-PAD-3-NC_BY_PASTE  [PAD-JUMPER-3-NC_BY_PASTE_YES_SILK_FULL_BOX]
JP71  JUMPER-PAD-3-NC_BY_PASTE  [PAD-JUMPER-3-NC_BY_PASTE_YES_SILK_FULL_BOX]
K29  DSBT2-M-2D-DC1.5V  [DS-BT]
LED23  GREEN  LED0603  [CHIPLED_0603]
Q40  MOSFET-NCHANNELAO3404A  [SOT23-3]
R552  10k  RESISTOR0402-RES  [0402-RES]
R553  0.001  0.001OHM-3W-1%(2512)3W/1%  [2512]
R554  0  RESISTOR0402-RES  [0402-RES]
R555  125  RESISTOR1206  [1206]
R556  250  RESISTOR0402-RES  [0402-RES]
R557  100k  RESISTOR0402-RES  [0402-RES]
R558  10k  RESISTOR0402-RES  [0402-RES]
R559  250  RESISTOR0402-RES  [0402-RES]
R560  47  RESISTOR0402-RES  [0402-RES]
R561  47  RESISTOR0402-RES  [0402-RES]
R562  10k  RESISTOR0402-RES  [0402-RES]
R563  0  RESISTOR1206  [1206]
R564  125  RESISTOR0402-RES  [0402-RES]
R565  125  RESISTOR0402-RES  [0402-RES]
R566  10k  RESISTOR0402-RES  [0402-RES]
R567  0  RESISTOR0805-RES  [0805]
R568  10k  RESISTOR0402-RES  [0402-RES]
R569  100k  RESISTOR0402-RES  [0402-RES]
R570  250  RESISTOR0402-RES  [0402-RES]
R571  250  RESISTOR0402-RES  [0402-RES]
TP95  TESTPOINT0.1"  [1X01_ROUND]
TP96  TESTPOINT0.1"  [1X01_ROUND]
TP97  TESTPOINT0.1"  [1X01_ROUND]
TP98  TESTPOINT0.1"  [1X01_ROUND]
U$103  SPTAF1/2-3.5  [SPTAF1/2-3.5]
U$104  SPTAF1/2-3.5  [SPTAF1/2-3.5]
U$105  SPTAF1/2-3.5  [SPTAF1/2-3.5]
U$106  MUX509  [R-PDSO-G16]

### Nets
A0: TP98.1 U$106.P$1(A0) ; also sheet 2,16,17,18,19,20,21,22,23,24,25,26,28,29,30,31
DAC12: R556.1 R569.2 TP97.1 ; also sheet 9
FB12: JP71.3 R568.1
GND: C464.2 C465.2 C466.2 C467.2 C468.2 C469.1 C470.1 C471.1 C472.2 C476.1 C477.1 D241.C D242.C IC72.5(REF) IC73.5(REF) Q40.2(S) R557.1 R562.1 R569.1 U$104.P$1 U$104.P$2 U$106.P$6(S3A) U$106.P$11(S3B) U$106.P$15(GND) ; also sheet 1,2,3,4,5,6,7,8,9,10,11,12,13,15,16,17,18,19,20,21,22,23,24,25,26,28,29,30,31
N$737: D234.A D235.C K29.4(2:P) R553.2 R566.1 R571.1
N$738: K29.13(3:P) R559.2
N$739: IC72.1(RG) R555.1
N$740: IC72.8(RG) R555.2
N$741: C464.1 IC71.3(+IN) R556.2
N$742: D236.A K29.16(1:-) Q40.3(D) R558.1
N$743: LED23.C R558.2
N$744: C473.1 C474.1 IC71.2(-IN) JP71.2 R562.2
N$745: C473.2 C475.2 R552.2 R553.1 R567.2 R570.1 U$103.P$3 U$103.P$4
N$746: IC72.6(OUT) R560.1
N$747: IC73.6(OUT) JP69.3 R561.1 R568.2
N$748: C474.2 C475.1 IC71.6(OUT) R554.1 R567.1
N$749: IC73.1(RG) R563.1
N$750: IC73.8(RG) R563.2
N$751: IC73.2(-IN) JP69.2
N$752: IC73.3(+IN) JP70.2
N$753: D239.C D240.A D242.A JP69.1 R564.2
N$754: R564.1 U$105.P$3 U$105.P$4
N$755: D237.C D238.A D241.A JP70.1 R565.2
N$756: R565.1 U$105.P$1 U$105.P$2
N$757: JP70.3 R566.2
N$758: JP71.1 R552.1 R559.1
N$759: R554.2 U$103.P$1 U$103.P$2
N$760: IC72.2(-IN) U$106.P$8(DA)
N$761: IC72.3(+IN) U$106.P$9(DB)
N$762: C478.2 R571.2 U$106.P$10(S4B)
N$763: C478.1 R570.2 U$106.P$7(S4A)
OUT12: K29.8(2:S) K29.9(3:S) U$104.P$3 U$104.P$4
SENSEI12: C472.1 R560.2 TP95.1 ; also sheet 7
SENSEV12: C471.2 R561.2 TP96.1 ; also sheet 7
SWITCH12: Q40.1(G) R557.2 ; also sheet 6
VCC: C466.1 C468.1 C470.2 C476.2 D234.C D236.C D238.C D240.C IC71.7(V+) IC72.7(V+) IC73.7(V+) K29.1(1:+) LED23.A U$106.P$2(EN) U$106.P$14(V+) U$106.P$16(A1) ; also sheet 1,2,3,7,8,11,13,15,16,17,18,19,20,21,22,23,24,25,26,28,29,30,31
VDD: C465.1 C467.1 C469.2 C477.2 D235.A D237.A D239.A IC71.4(V-) IC72.4(V-) IC73.4(V-) U$106.P$3(V-) ; also sheet 1,3,7,8,15,16,17,18,19,20,21,22,23,24,25,26,28,29,30,31
Unconnected: K29.6(2:O) K29.11(3:O) U$106.P$4(S1A) U$106.P$5(S2A) U$106.P$12(S2B) U$106.P$13(S1B)

## Sheet 28 of 31
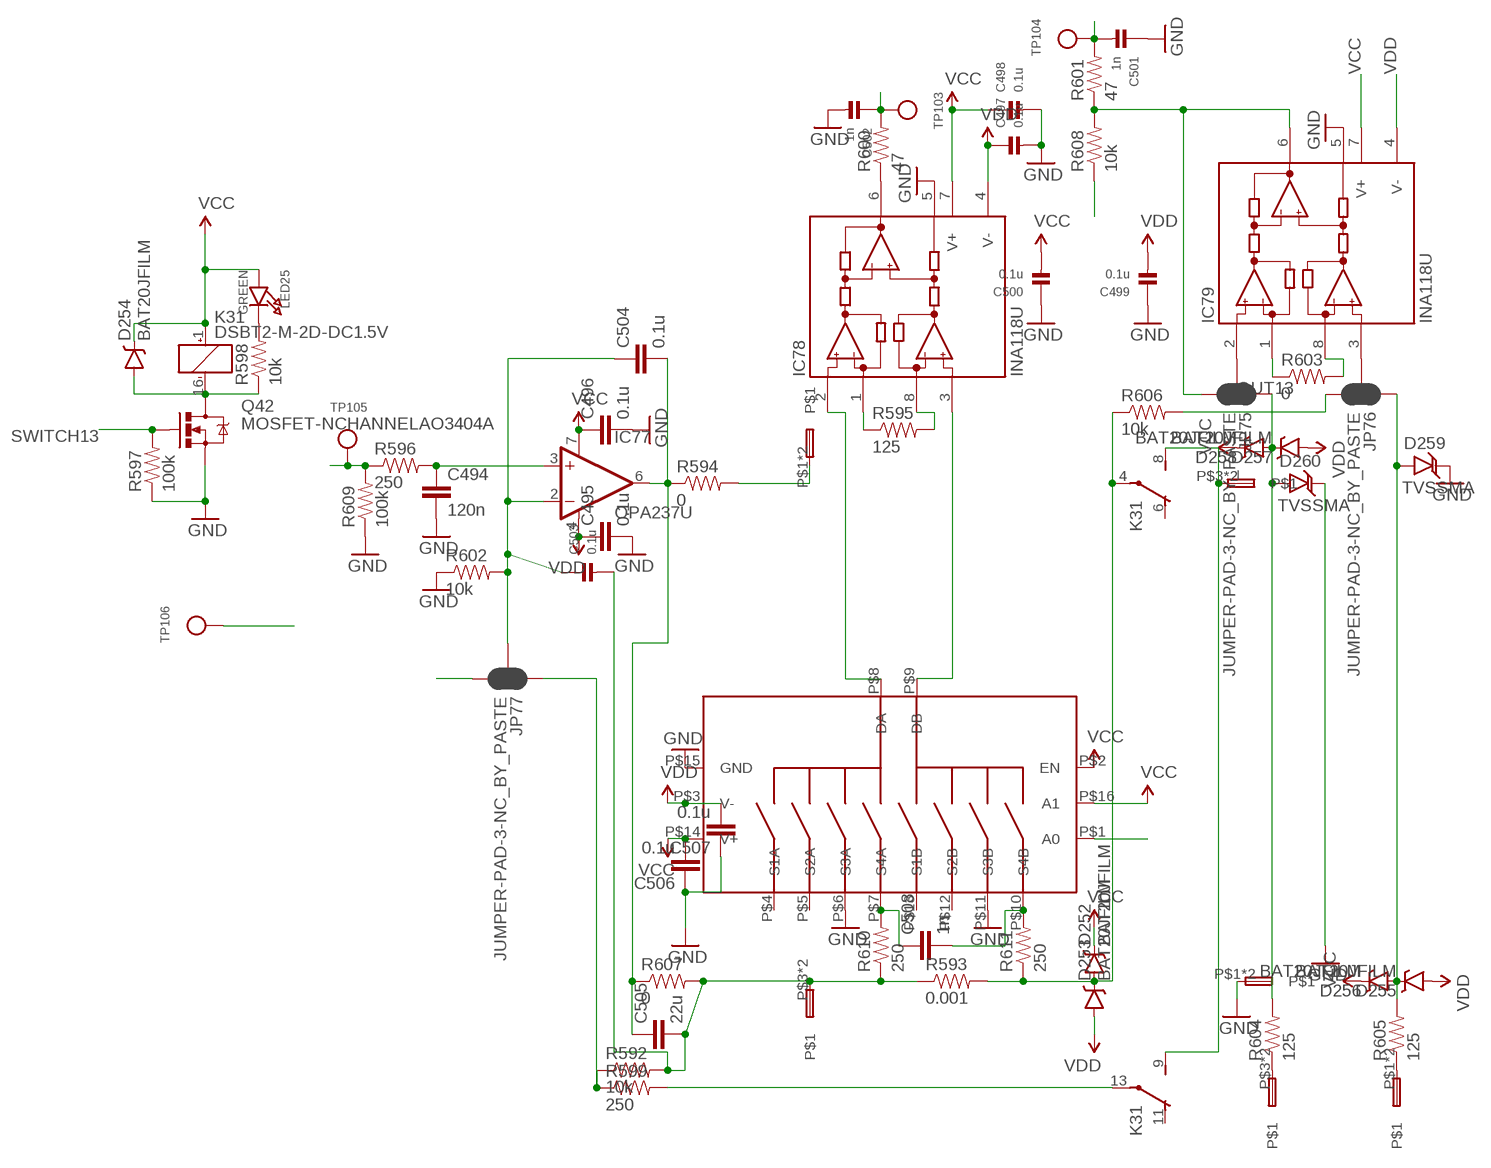
[diagram p27: schematic, sheet 28]

### Parts
C494  120n  CAP0402-CAP  [0402-CAP]
C495  0.1u  CAP0402-CAP  [0402-CAP]
C496  0.1u  CAP0402-CAP  [0402-CAP]
C497  0.1u  CAP_CERAMIC0402  [0402]
C498  0.1u  CAP_CERAMIC0402  [0402]
C499  0.1u  CAP_CERAMIC0402  [0402]
C500  0.1u  CAP_CERAMIC0402  [0402]
C501  1n  CAP_CERAMIC0402  [0402]
C502  1n  CAP_CERAMIC0402  [0402]
C503  0.1u  CAP_CERAMIC0402  [0402]
C504  0.1u  CAP0603-CAP  [0603-CAP]
C505  22u  CAP0805  [0805]
C506  0.1u  CAP0402-CAP  [0402-CAP]
C507  0.1u  CAP0402-CAP  [0402-CAP]
C508  1n  CAP0402-CAP  [0402-CAP]
D252  BAT20JFILM  [SOD-323]
D253  BAT20JFILM  [SOD-323]
D254  BAT20JFILM  [SOD-323]
D255  BAT20JFILM  [SOD-323]
D256  BAT20JFILM  [SOD-323]
D257  BAT20JFILM  [SOD-323]
D258  BAT20JFILM  [SOD-323]
D259  TVSSMA  [SMA-DIODE]
D260  TVSSMA  [SMA-DIODE]
IC77  OPA237U  [SO08]
IC78  INA118U  [SO08]
IC79  INA118U  [SO08]
JP75  JUMPER-PAD-3-NC_BY_PASTE  [PAD-JUMPER-3-NC_BY_PASTE_YES_SILK_FULL_BOX]
JP76  JUMPER-PAD-3-NC_BY_PASTE  [PAD-JUMPER-3-NC_BY_PASTE_YES_SILK_FULL_BOX]
JP77  JUMPER-PAD-3-NC_BY_PASTE  [PAD-JUMPER-3-NC_BY_PASTE_YES_SILK_FULL_BOX]
K31  DSBT2-M-2D-DC1.5V  [DS-BT]
LED25  GREEN  LED0603  [CHIPLED_0603]
Q42  MOSFET-NCHANNELAO3404A  [SOT23-3]
R592  10k  RESISTOR0402-RES  [0402-RES]
R593  0.001  0.001OHM-3W-1%(2512)3W/1%  [2512]
R594  0  RESISTOR0402-RES  [0402-RES]
R595  125  RESISTOR1206  [1206]
R596  250  RESISTOR0402-RES  [0402-RES]
R597  100k  RESISTOR0402-RES  [0402-RES]
R598  10k  RESISTOR0402-RES  [0402-RES]
R599  250  RESISTOR0402-RES  [0402-RES]
R600  47  RESISTOR0402-RES  [0402-RES]
R601  47  RESISTOR0402-RES  [0402-RES]
R602  10k  RESISTOR0402-RES  [0402-RES]
R603  0  RESISTOR1206  [1206]
R604  125  RESISTOR0402-RES  [0402-RES]
R605  125  RESISTOR0402-RES  [0402-RES]
R606  10k  RESISTOR0402-RES  [0402-RES]
R607  0  RESISTOR0805-RES  [0805]
R608  10k  RESISTOR0402-RES  [0402-RES]
R609  100k  RESISTOR0402-RES  [0402-RES]
R610  250  RESISTOR0402-RES  [0402-RES]
R611  250  RESISTOR0402-RES  [0402-RES]
TP103  TESTPOINT0.1"  [1X01_ROUND]
TP104  TESTPOINT0.1"  [1X01_ROUND]
TP105  TESTPOINT0.1"  [1X01_ROUND]
TP106  TESTPOINT0.1"  [1X01_ROUND]
U$111  SPTAF1/2-3.5  [SPTAF1/2-3.5]
U$112  SPTAF1/2-3.5  [SPTAF1/2-3.5]
U$113  SPTAF1/2-3.5  [SPTAF1/2-3.5]
U$114  MUX509  [R-PDSO-G16]

### Nets
A0: TP106.1 U$114.P$1(A0) ; also sheet 2,16,17,18,19,20,21,22,23,24,25,26,27,29,30,31
DAC13: R596.1 R609.2 TP105.1 ; also sheet 9
FB13: JP77.3 R608.1
GND: C494.2 C495.2 C496.2 C497.2 C498.2 C499.1 C500.1 C501.1 C502.2 C506.1 C507.1 D259.C D260.C IC78.5(REF) IC79.5(REF) Q42.2(S) R597.1 R602.1 R609.1 U$112.P$1 U$112.P$2 U$114.P$6(S3A) U$114.P$11(S3B) U$114.P$15(GND) ; also sheet 1,2,3,4,5,6,7,8,9,10,11,12,13,15,16,17,18,19,20,21,22,23,24,25,26,27,29,30,31
N$791: D252.A D253.C K31.4(2:P) R593.2 R606.1 R611.1
N$792: K31.13(3:P) R599.2
N$793: IC78.1(RG) R595.1
N$794: IC78.8(RG) R595.2
N$795: C494.1 IC77.3(+IN) R596.2
N$796: D254.A K31.16(1:-) Q42.3(D) R598.1
N$797: LED25.C R598.2
N$798: C503.1 C504.1 IC77.2(-IN) JP77.2 R602.2
N$799: C503.2 C505.2 R592.2 R593.1 R607.2 R610.1 U$111.P$3 U$111.P$4
N$800: IC78.6(OUT) R600.1
N$801: IC79.6(OUT) JP75.3 R601.1 R608.2
N$802: C504.2 C505.1 IC77.6(OUT) R594.1 R607.1
N$803: IC79.1(RG) R603.1
N$804: IC79.8(RG) R603.2
N$805: IC79.2(-IN) JP75.2
N$806: IC79.3(+IN) JP76.2
N$807: D257.C D258.A D260.A JP75.1 R604.2
N$808: R604.1 U$113.P$3 U$113.P$4
N$809: D255.C D256.A D259.A JP76.1 R605.2
N$810: R605.1 U$113.P$1 U$113.P$2
N$811: JP76.3 R606.2
N$812: JP77.1 R592.1 R599.1
N$813: R594.2 U$111.P$1 U$111.P$2
N$814: IC78.2(-IN) U$114.P$8(DA)
N$815: IC78.3(+IN) U$114.P$9(DB)
N$816: C508.2 R611.2 U$114.P$10(S4B)
N$817: C508.1 R610.2 U$114.P$7(S4A)
OUT13: K31.8(2:S) K31.9(3:S) U$112.P$3 U$112.P$4
SENSEI13: C502.1 R600.2 TP103.1 ; also sheet 7
SENSEV13: C501.2 R601.2 TP104.1 ; also sheet 7
SWITCH13: Q42.1(G) R597.2 ; also sheet 6
VCC: C496.1 C498.1 C500.2 C506.2 D252.C D254.C D256.C D258.C IC77.7(V+) IC78.7(V+) IC79.7(V+) K31.1(1:+) LED25.A U$114.P$2(EN) U$114.P$14(V+) U$114.P$16(A1) ; also sheet 1,2,3,7,8,11,13,15,16,17,18,19,20,21,22,23,24,25,26,27,29,30,31
VDD: C495.1 C497.1 C499.2 C507.2 D253.A D255.A D257.A IC77.4(V-) IC78.4(V-) IC79.4(V-) U$114.P$3(V-) ; also sheet 1,3,7,8,15,16,17,18,19,20,21,22,23,24,25,26,27,29,30,31
Unconnected: K31.6(2:O) K31.11(3:O) U$114.P$4(S1A) U$114.P$5(S2A) U$114.P$12(S2B) U$114.P$13(S1B)